# EAGLE design SPI2Parallel_v1p1 (EAGLE 9.6.2)

## Sheet 1 of 2
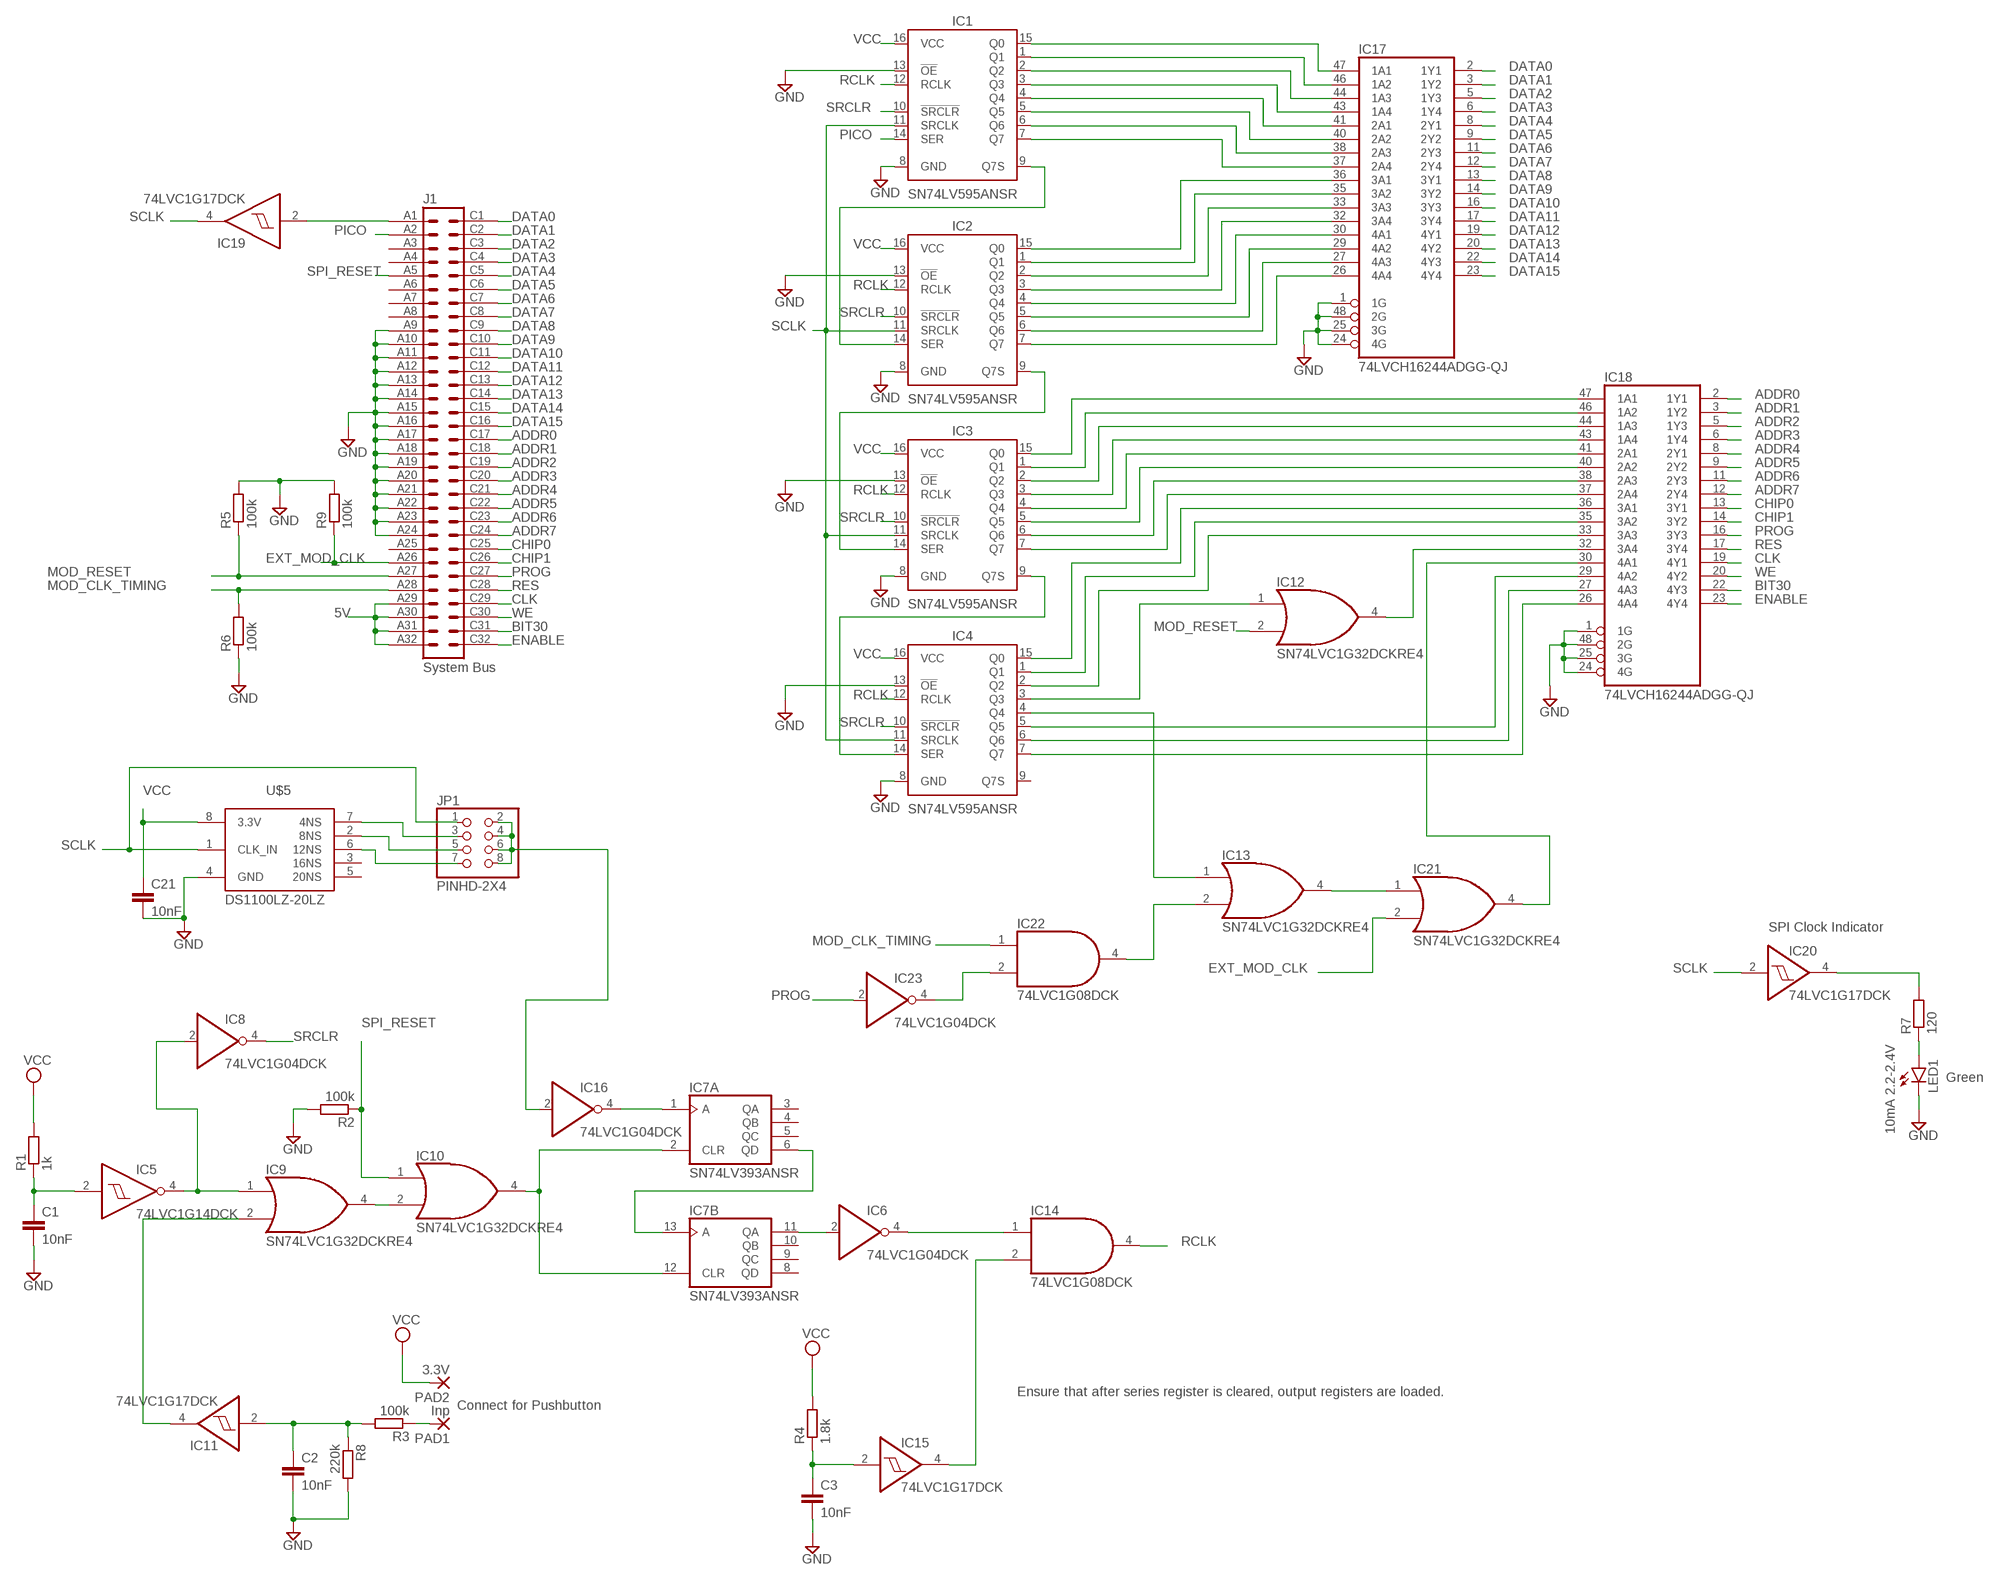
[diagram p0: schematic, sheet 1]

### Parts
C1  10nF  C-EUC0603  [C0603]
C2  10nF  C-EUC0603  [C0603]
C3  10nF  C-EUC0603  [C0603]
C21  10nF  C-EUC0603  [C0603]
IC1  SN74LV595ANSR  74HC595_SOIC  [SOIC127P600X175-16N]
IC2  SN74LV595ANSR  74HC595_SOIC  [SOIC127P600X175-16N]
IC3  SN74LV595ANSR  74HC595_SOIC  [SOIC127P600X175-16N]
IC4  SN74LV595ANSR  74HC595_SOIC  [SOIC127P600X175-16N]
IC5  74LVC1G14DCK  [SC70-5]
IC6  74LVC1G04DCK  [SC70-5]
IC7  SN74LV393ANSR  74AC393D  [SO14]
IC8  74LVC1G04DCK  [SC70-5]
IC9  SN74LVC1G32DCKRE4  74AHCT1G32DCK  [SC70-5]
IC10  SN74LVC1G32DCKRE4  74AHCT1G32DCK  [SC70-5]
IC11  74LVC1G17DCK  [SC70-5]
IC12  SN74LVC1G32DCKRE4  74AUC1G32DCK  [SC70-5]
IC13  SN74LVC1G32DCKRE4  74AUC1G32DCK  [SC70-5]
IC14  74LVC1G08DCK  [SC70-5]
IC15  74LVC1G17DCK  [SC70-5]
IC16  74LVC1G04DCK  [SC70-5]
IC17  74LVCH16244ADGG-QJ  74AC16244  [SSOP48DL]
IC18  74LVCH16244ADGG-QJ  74AC16244  [SSOP48DL]
IC19  74LVC1G17DCK  [SC70-5]
IC20  74LVC1G17DCK  [SC70-5]
IC21  SN74LVC1G32DCKRE4  74AUC1G32DCK  [SC70-5]
IC22  74LVC1G08DCK  [SC70-5]
IC23  74LVC1G04DCK  [SC70-5]
J1  System Bus  VG64P  [VG64P]
JP1  PINHD-2X4  [2X04]
LED1  10mA 2.2-2.4V  LED3MM  [LED3MM]
PAD1  Inp  SMD5  [SMD2,54-5,08]
PAD2  3.3V  SMD5  [SMD2,54-5,08]
R1  1k  R-EU_R0603  [R0603]
R2  100k  R-EU_R0603  [R0603]
R3  100k  R-EU_R0603  [R0603]
R4  1.8k  R-EU_R0603  [R0603]
R5  100k  R-EU_R0603  [R0603]
R6  100k  R-EU_R0603  [R0603]
R7  120  R-EU_R0603  [R0603]
R8  220k  R-EU_R0603  [R0603]
R9  100k  R-EU_R0603  [R0603]
U$5  DS1100LZ-20LZ  [SO-08]

### Nets
5V: J1.A29 J1.A30 J1.A31 J1.A32 ; also sheet 2
ADDR0: IC18.2(1Y1) J1.C17
ADDR1: IC18.3(1Y2) J1.C18
ADDR2: IC18.5(1Y3) J1.C19
ADDR3: IC18.6(1Y4) J1.C20
ADDR4: IC18.8(2Y1) J1.C21
ADDR5: IC18.9(2Y2) J1.C22
ADDR6: IC18.11(2Y3) J1.C23
ADDR7: IC18.12(2Y4) J1.C24
BIT30: IC18.22(4Y3) J1.C31
CHIP0: IC18.13(3Y1) J1.C25
CHIP1: IC18.14(3Y2) J1.C26
CLK: IC18.19(4Y1) J1.C29
DATA0: IC17.2(1Y1) J1.C1
DATA1: IC17.3(1Y2) J1.C2
DATA2: IC17.5(1Y3) J1.C3
DATA3: IC17.6(1Y4) J1.C4
DATA4: IC17.8(2Y1) J1.C5
DATA5: IC17.9(2Y2) J1.C6
DATA6: IC17.11(2Y3) J1.C7
DATA7: IC17.12(2Y4) J1.C8
DATA8: IC17.13(3Y1) J1.C9
DATA9: IC17.14(3Y2) J1.C10
DATA10: IC17.16(3Y3) J1.C11
DATA11: IC17.17(3Y4) J1.C12
DATA12: IC17.19(4Y1) J1.C13
DATA13: IC17.20(4Y2) J1.C14
DATA14: IC17.22(4Y3) J1.C15
DATA15: IC17.23(4Y4) J1.C16
ENABLE: IC18.23(4Y4) J1.C32
EXT_MOD_CLK: IC21.2(I1) J1.A26 R9.1
GND: C1.2 C2.2 C3.2 C21.2 IC1.8(GND) IC1.13(!OE) IC2.8(GND) IC2.13(!OE) IC3.8(GND) IC3.13(!OE) IC4.8(GND) IC4.13(!OE) IC17.1(1G) IC17.24(4G) IC17.25(3G) IC17.48(2G) IC18.1(1G) IC18.24(4G) IC18.25(3G) IC18.48(2G) J1.A9 J1.A10 J1.A11 J1.A12 J1.A13 J1.A14 J1.A15 J1.A16 J1.A17 J1.A18 J1.A19 J1.A20 J1.A21 J1.A22 J1.A23 J1.A24 LED1.K(C) R2.2 R5.2 R6.1 R8.2 R9.2 U$5.4(GND) ; also sheet 2
MOD_CLK_TIMING: IC22.1(I0) J1.A28 R6.2
MOD_RESET: IC12.2(I1) J1.A27 R5.1
N$1: IC1.9(Q7S) IC2.14(SER)
N$2: IC2.9(Q7S) IC3.14(SER)
N$3: IC3.9(Q7S) IC4.14(SER)
N$4: IC7.6(A:QD) IC7.13(B:A)
N$5: IC6.2(I) IC7.11(B:QA)
N$6: C1.1 IC5.2(I) R1.1
N$7: IC7.2(A:CLR) IC7.12(B:CLR) IC10.4(O)
N$8: IC9.4(O) IC10.2(I1)
N$9: IC5.4(O) IC8.2(I) IC9.1(I0)
N$10: C2.1 IC11.2(I) R3.2 R8.1
N$11: IC9.2(I1) IC11.4(O)
N$12: PAD1.1(P) R3.1
N$13: IC4.3(Q3) IC12.1(I0)
N$14: IC4.4(Q4) IC13.1(I0)
N$15: IC6.4(O) IC14.1(I0)
N$16: C3.1 IC15.2(I) R4.1
N$17: IC14.2(I1) IC15.4(O)
N$18: IC7.1(A:A) IC16.4(O)
N$19: IC1.15(Q0) IC17.47(1A1)
N$20: IC1.1(Q1) IC17.46(1A2)
N$21: IC1.2(Q2) IC17.44(1A3)
N$22: IC1.3(Q3) IC17.43(1A4)
N$23: IC1.4(Q4) IC17.41(2A1)
N$24: IC1.5(Q5) IC17.40(2A2)
N$25: IC1.6(Q6) IC17.38(2A3)
N$26: IC1.7(Q7) IC17.37(2A4)
N$27: IC2.15(Q0) IC17.36(3A1)
N$28: IC2.1(Q1) IC17.35(3A2)
N$29: IC2.2(Q2) IC17.33(3A3)
N$30: IC2.3(Q3) IC17.32(3A4)
N$31: IC2.4(Q4) IC17.30(4A1)
N$32: IC2.5(Q5) IC17.29(4A2)
N$33: IC2.6(Q6) IC17.27(4A3)
N$34: IC2.7(Q7) IC17.26(4A4)
N$35: IC3.15(Q0) IC18.47(1A1)
N$36: IC3.1(Q1) IC18.46(1A2)
N$37: IC3.2(Q2) IC18.44(1A3)
N$38: IC3.3(Q3) IC18.43(1A4)
N$39: IC3.4(Q4) IC18.41(2A1)
N$40: IC3.5(Q5) IC18.40(2A2)
N$41: IC3.6(Q6) IC18.38(2A3)
N$42: IC3.7(Q7) IC18.37(2A4)
N$43: IC4.15(Q0) IC18.36(3A1)
N$44: IC4.1(Q1) IC18.35(3A2)
N$45: IC4.2(Q2) IC18.33(3A3)
N$46: IC12.4(O) IC18.32(3A4)
N$47: IC18.30(4A1) IC21.4(O)
N$48: IC4.5(Q5) IC18.29(4A2)
N$49: IC4.6(Q6) IC18.27(4A3)
N$50: IC4.7(Q7) IC18.26(4A4)
N$51: IC16.2(I) JP1.2 JP1.4 JP1.6 JP1.8
N$52: JP1.7 U$5.6(12NS)
N$53: JP1.3 U$5.7(4NS)
N$54: JP1.5 U$5.2(8NS)
N$55: IC19.2(I) J1.A1
N$56: IC13.4(O) IC21.1(I0)
N$57: IC13.2(I1) IC22.4(O)
N$58: IC22.2(I1) IC23.4(O)
N$106: IC20.4(O) R7.2
N$123: LED1.A R7.1
PICO: IC1.14(SER) J1.A2
PROG: IC18.16(3Y3) IC23.2(I) J1.C27
RCLK: IC1.12(RCLK) IC2.12(RCLK) IC3.12(RCLK) IC4.12(RCLK) IC14.4(O)
RES: IC18.17(3Y4) J1.C28
SCLK: IC1.11(SRCLK) IC2.11(SRCLK) IC3.11(SRCLK) IC4.11(SRCLK) IC19.4(O) IC20.2(I) JP1.1 U$5.1(CLK_IN)
SPI_RESET: IC10.1(I0) J1.A5 R2.1
SRCLR: IC1.10(!SRCLR) IC2.10(!SRCLR) IC3.10(!SRCLR) IC4.10(!SRCLR) IC8.4(O)
VCC: C21.1 IC1.16(VCC) IC2.16(VCC) IC3.16(VCC) IC4.16(VCC) PAD2.1(P) R1.2 R4.2 U$5.8(3.3V) ; also sheet 2
WE: IC18.20(4Y2) J1.C30
Unconnected: IC4.9(Q7S) IC7.3(A:QA) IC7.4(A:QB) IC7.5(A:QC) IC7.8(B:QD) IC7.9(B:QC) IC7.10(B:QB) J1.A3 J1.A4 J1.A6 J1.A7 J1.A8 J1.A25 U$5.3(16NS) U$5.5(20NS)

### Notes on the sheet
- SPI Clock Indicator
- Green
- Ensure that after series register is cleared, output registers are loaded.
- Connect for Pushbutton

## Sheet 2 of 2
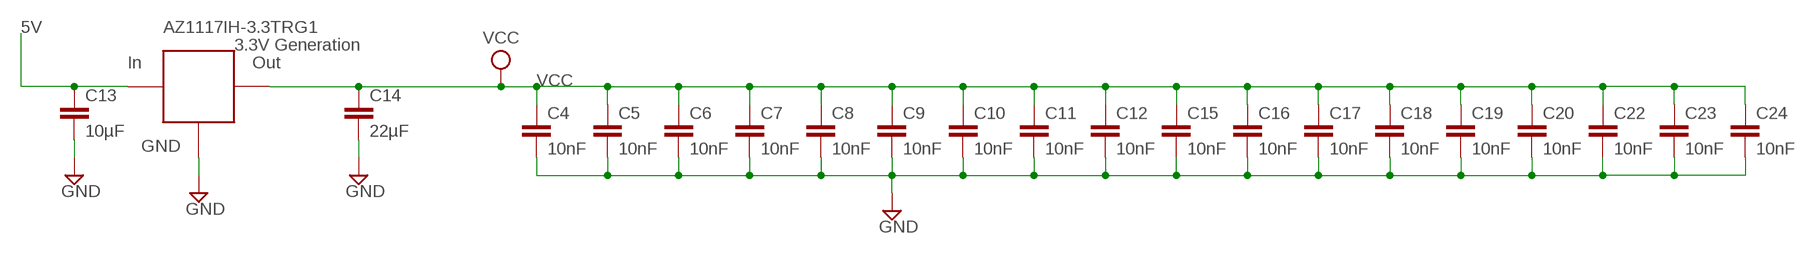
[diagram p1: schematic, sheet 2]

### Parts
C4  10nF  C-EUC0603  [C0603]
C5  10nF  C-EUC0603  [C0603]
C6  10nF  C-EUC0603  [C0603]
C7  10nF  C-EUC0603  [C0603]
C8  10nF  C-EUC0603  [C0603]
C9  10nF  C-EUC0603  [C0603]
C10  10nF  C-EUC0603  [C0603]
C11  10nF  C-EUC0603  [C0603]
C12  10nF  C-EUC0603  [C0603]
C13  10µF  C-EUC1206  [C1206]
C14  22µF  C-EUC1206  [C1206]
C15  10nF  C-EUC0603  [C0603]
C16  10nF  C-EUC0603  [C0603]
C17  10nF  C-EUC0603  [C0603]
C18  10nF  C-EUC0603  [C0603]
C19  10nF  C-EUC0603  [C0603]
C20  10nF  C-EUC0603  [C0603]
C22  10nF  C-EUC0603  [C0603]
C23  10nF  C-EUC0603  [C0603]
C24  10nF  C-EUC0603  [C0603]
U$9  AZ1117IH-3.3TRG1  LT1117  [SOT223]

### Nets
5V: C13.1 U$9.3(IN) ; also sheet 1
GND: C4.2 C5.2 C6.2 C7.2 C8.2 C9.2 C10.2 C11.2 C12.2 C13.2 C14.2 C15.2 C16.2 C17.2 C18.2 C19.2 C20.2 C22.2 C23.2 C24.2 U$9.1(GND) ; also sheet 1
VCC: C4.1 C5.1 C6.1 C7.1 C8.1 C9.1 C10.1 C11.1 C12.1 C14.1 C15.1 C16.1 C17.1 C18.1 C19.1 C20.1 C22.1 C23.1 C24.1 U$9.2(VCC) U$9.4(VCC) ; also sheet 1

### Notes on the sheet
- 3.3V Generation

## Power pins joined to a net without a drawn wire
GND: IC5.3(GND) IC6.3(GND) IC7.7(P:GND) IC8.3(GND) IC9.3(GND) IC10.3(GND) IC11.3(GND) IC12.3(GND) IC13.3(GND) IC14.3(GND) IC15.3(GND) IC16.3(GND) IC17.4(GND) IC17.10(GND) IC17.15(GND) IC17.21(GND) IC17.28(GND) IC17.34(GND) IC17.39(GND) IC17.45(GND) IC18.4(GND) IC18.10(GND) IC18.15(GND) IC18.21(GND) IC18.28(GND) IC18.34(GND) IC18.39(GND) IC18.45(GND) IC19.3(GND) IC20.3(GND) IC21.3(GND) IC22.3(GND) IC23.3(GND)
VCC: IC5.5(VCC) IC6.5(VCC) IC7.14(P:VCC) IC8.5(VCC) IC9.5(VCC) IC10.5(VCC) IC11.5(VCC) IC12.5(VCC) IC13.5(VCC) IC14.5(VCC) IC15.5(VCC) IC16.5(VCC) IC17.7(VCC) IC17.18(VCC) IC17.31(VCC) IC17.42(VCC) IC18.7(VCC) IC18.18(VCC) IC18.31(VCC) IC18.42(VCC) IC19.5(VCC) IC20.5(VCC) IC21.5(VCC) IC22.5(VCC) IC23.5(VCC)

## Library data of the parts
C1-C24 = rcl:C-EU: CAPACITOR, European symbol; SPICEPREFIX: C
IC1-IC4 = IC_Logic:74HC595: 8-Bit Shift Registers Reference Datasheet <https://www.ti.com/lit/ds/symlink/sn74hc595.pdf?ts=1637559852861&ref_url=https%253A%252F%252Fwww.google.com%252F>; CATEGORY: IC_Logic; DESCRIPTION: 8-Bit Shift Registers; MANUFACTURER: Generic; MPN: Generic; SUB-CATEGORY: Shift Register; TYPE: 8-Bit
IC5 = 74xx-little-us:74*1G14: Single Schmitt-Trigger Inverter Gate
IC6 IC8 IC16 IC23 = 74xx-little-de:74*1G04: INVERTER Gate
IC7 = 74xx-eu:74*393: Dual 4-bit decade and binary COUNTER
IC9 IC10 IC12 IC13 IC21 = 74xx-little-us:74*1G32: 2-input OR gate
IC11 IC15 IC20 = 74xx-little-de:74*1G17: Single Schmitt-Trigger Buffer
IC14 IC22 = 74xx-little-us:74*1G08: 2-input AND gate
IC17 IC18 = 74ac-logic:74AC16244: 16-bit BUFFER/LINE DRIVER, 3-state
IC19 = 74xx-little-us:74*1G17: Single Schmitt-Trigger Buffer
J1 = 19inch:VG64: PCB EUROCARD, 64-pin type C/AC, 2.54 mm
JP1 = Connector:PINHD-2X4: PIN HEADER; CATEGORY: CONNECTOR; SUB-CATEGORY: PIN-HEADER
LED1 = led:LED: LED OSRAM: - CHIPLED LG R971, LG N971, LY N971, LG Q971, LY Q971, LO R971, LY R971 LH N974, LH R974 LS Q976, LO Q976, LY Q976 LO Q996 - Hyper CHIPLED LW Q18S LB Q993, LB Q99A, LB R99A - SideLED LS A670, LO A670, LY A670, LG A670, LP A670 LB A673, LV A673, LT A673, LW A673 LH A674 LY A675 LS A676, LA A676, LO A676, LY A676, LW A676 LS A679, LY A679, LG A679 - Hyper Micro SIDELED® LS Y876, LA Y876, LO Y876, LY Y876 LT Y87S - SmartLED LW L88C, LW L88S LB L89C, LB L89S, LG L890 LS L89K, LO L89K, LY L89K LS L896, LA L896, LO L896, LY L896 - TOPLED LS T670, LO T670, LY T670, LG T670, LP T670 LSG T670, LSP T670, LSY T670, LOP T670, LYG T670 LG T671, LOG T671, LSG T671 LB T673, LV T673, LT T673, LW T673 LH T674 LS T676, LA T676, LO T676, LY T676, LB T676, LH T676, LSB T676, LW T676 LB T67C, LV T67C, LT T67C, LS T67K, LO T67K, LY T67K, LW E67C LS E67B, LA E67B, LO E67B, LY E67B, LB E67C, LV E67C, LT E67C LW T67C LS T679, LY T679, LG T679 LS T770, LO T770, LY T770, LG T770, LP T770 LB T773, LV T773, LT T773, LW T773 LH T774 LS E675, LA E675, LY E675, LS T675 LS T776, LA T776, LO T776, LY T776, LB T776 LHGB T686 LT T68C, LB T68C - Hyper Mini TOPLED® LB M676 - Mini TOPLED Santana® LG M470 LS M47K, LO M47K, LY M47K Source: http://www.osram.convergy.de LUXEON: - LUMILED® LXK2-PW12-R00, LXK2-PW12-S00, LXK2-PW14-U00, LXK2-PW14-V00 LXK2-PM12-R00, LXK2-PM12-S00, LXK2-PM14-U00 LXK2-PE12-Q00, LXK2-PE12-R00, LXK2-PE12-S00, LXK2-PE14-T00, LXK2-PE14-U00 LXK2-PB12-K00, LXK2-PB12-L00, LXK2-PB12-M00, LXK2-PB14-N00, LXK2-PB14-P00, LXK2-PB14-Q00 LXK2-PR12-L00, LXK2-PR12-M00, LXK2-PR14-Q00, LXK2-PR14-R00 LXK2-PD12-Q00, LXK2-PD12-R00, LXK2-PD12-S00 LXK2-PH12-R00, LXK2-PH12-S00 LXK2-PL12-P00, LXK2-PL12-Q00, LXK2-PL12-R00 Source: www.luxeon.com KINGBRIGHT: KA-3528ASYC Source: www.kingbright.com
PAD1 PAD2 = wirepad:SMD5: SMD PAD
R1-R9 = rcl:R-EU_: RESISTOR, European symbol; SPICEPREFIX: R
U$5 = Orzada:DS1100LZ-20: 5-Tap Timing Element, 4,8,12,16,20 ns delay.
U$9 = Orzada:LT1117

## Board
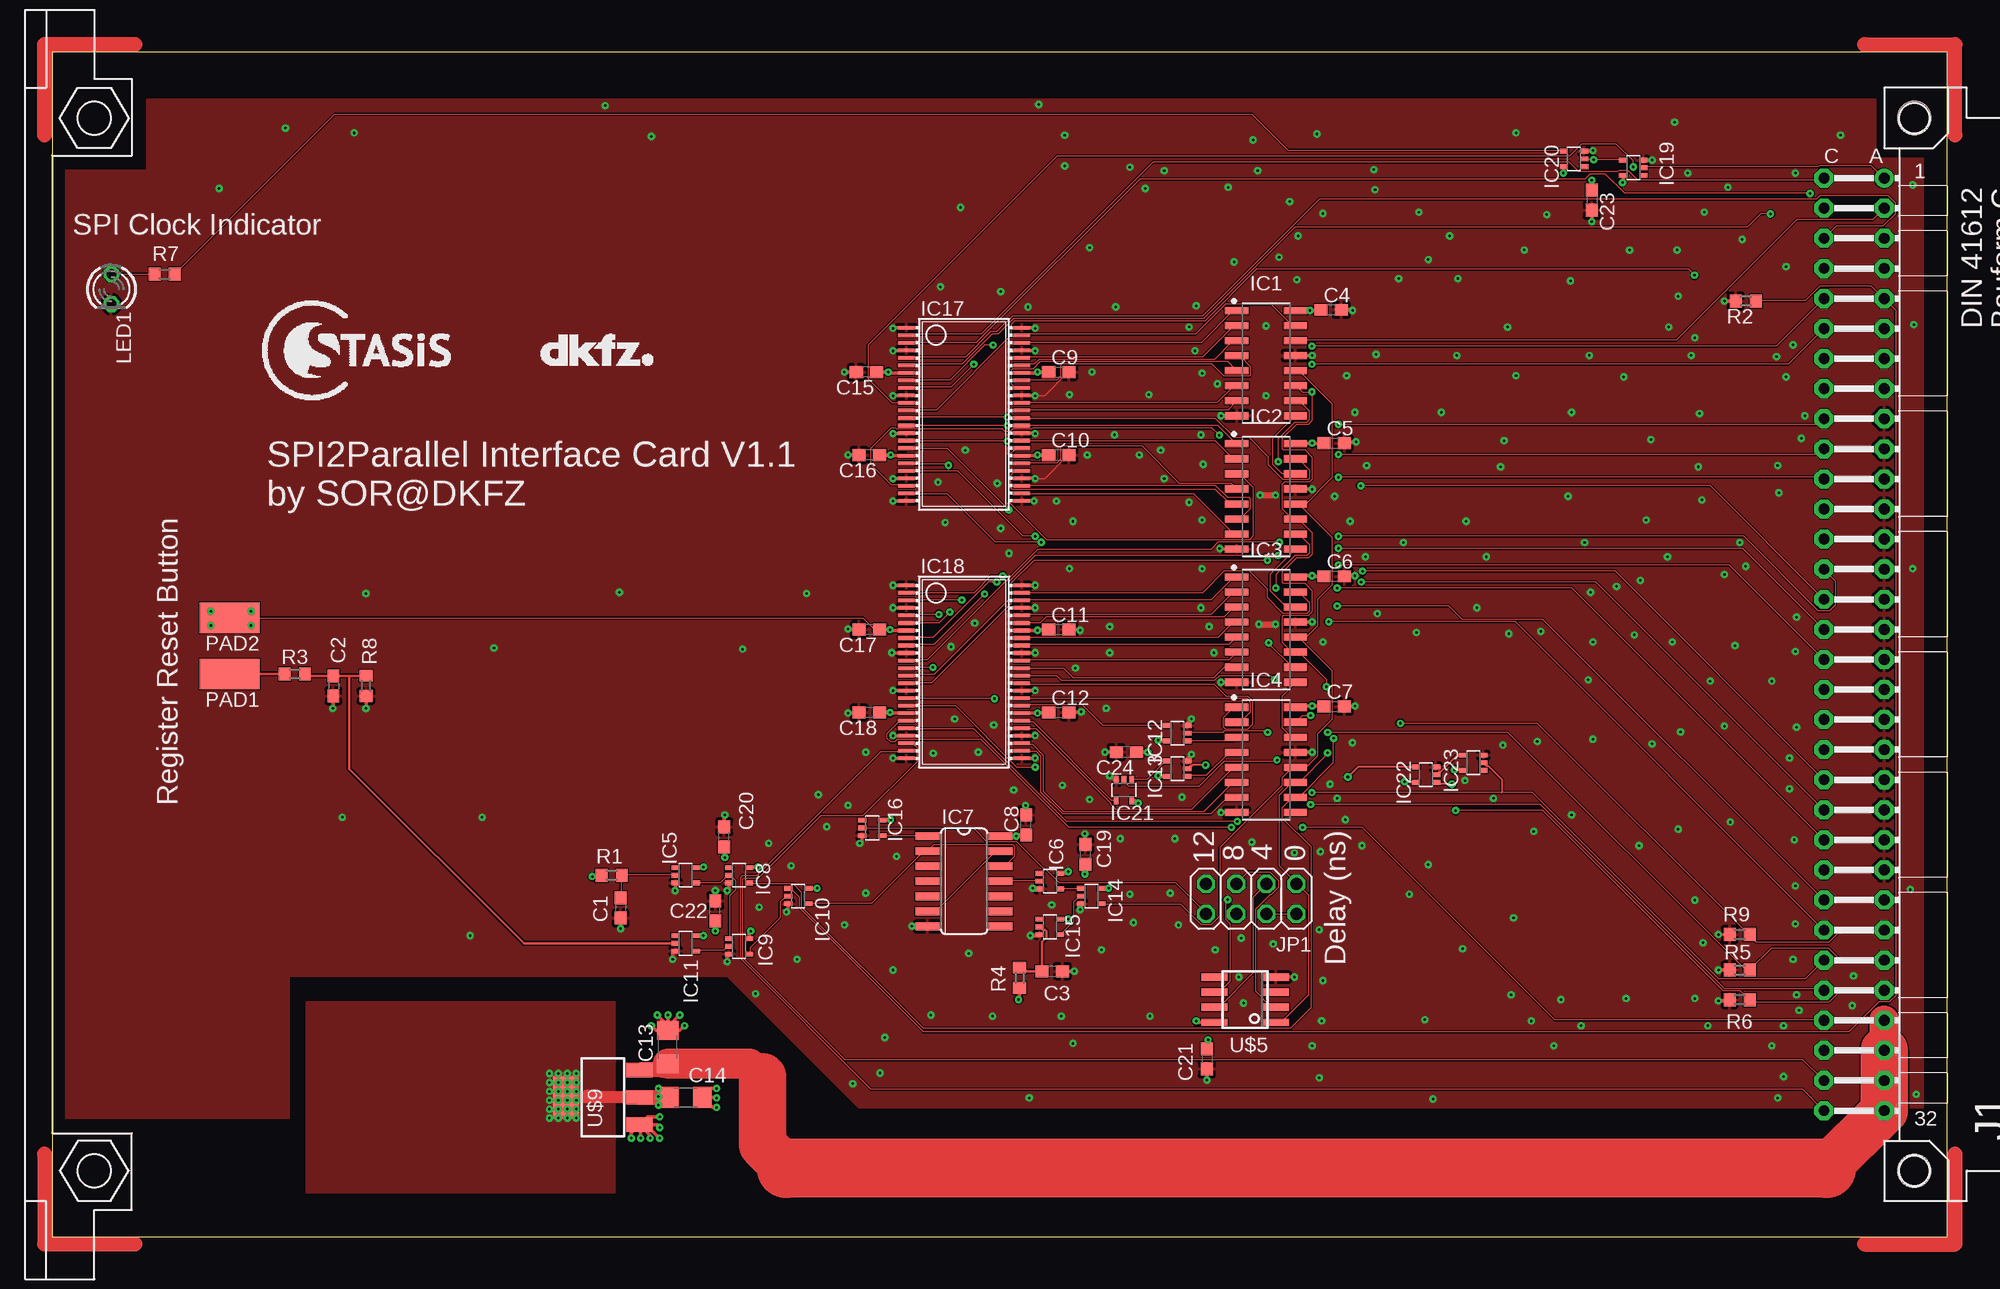
[diagram p2: board, top side]
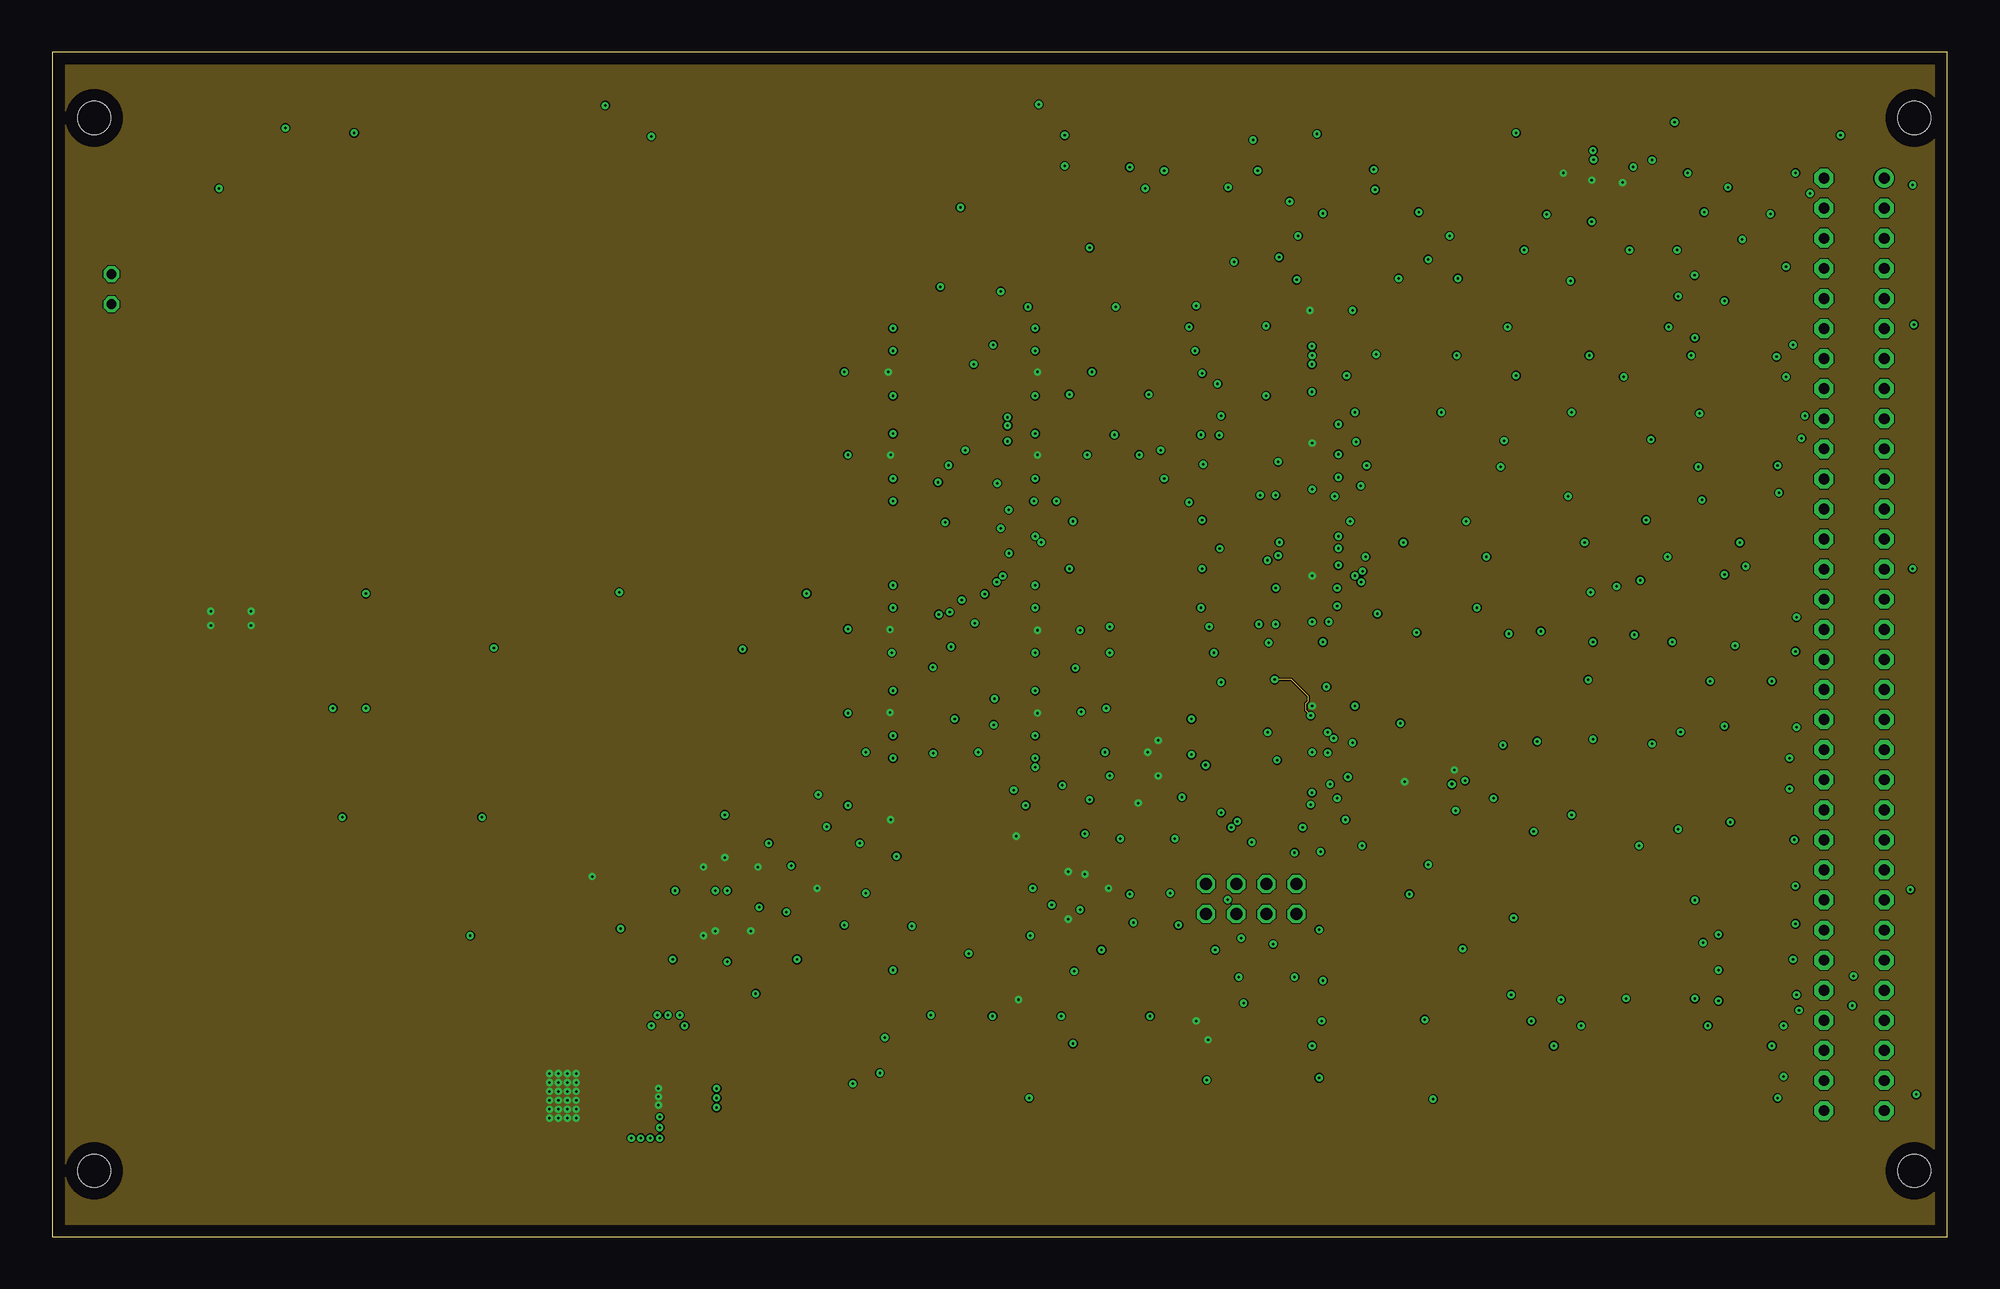
[diagram p3: board, inner layer VCC]
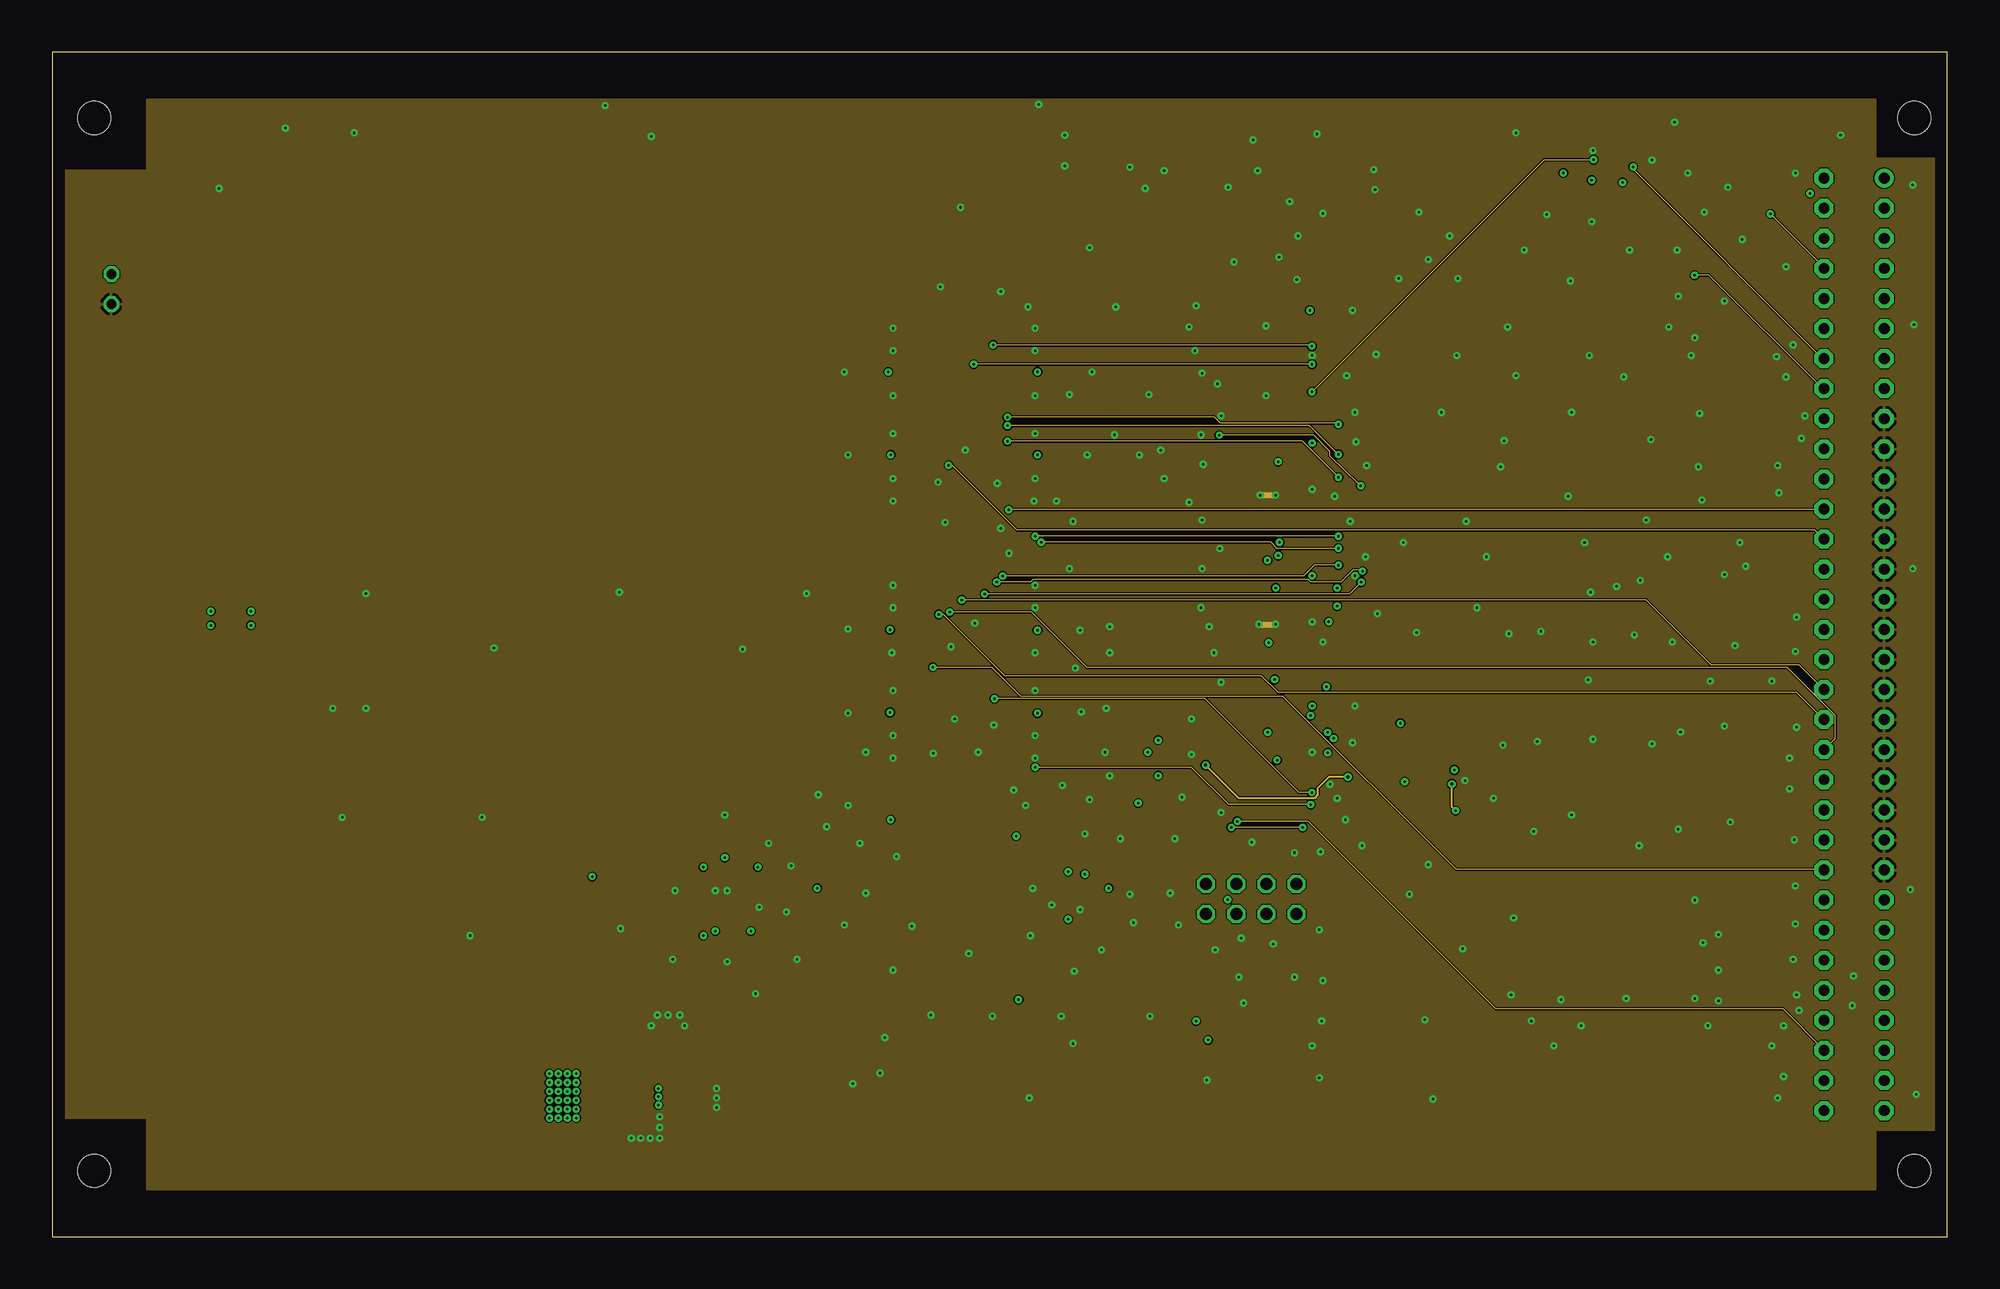
[diagram p4: board, inner layer Route15]
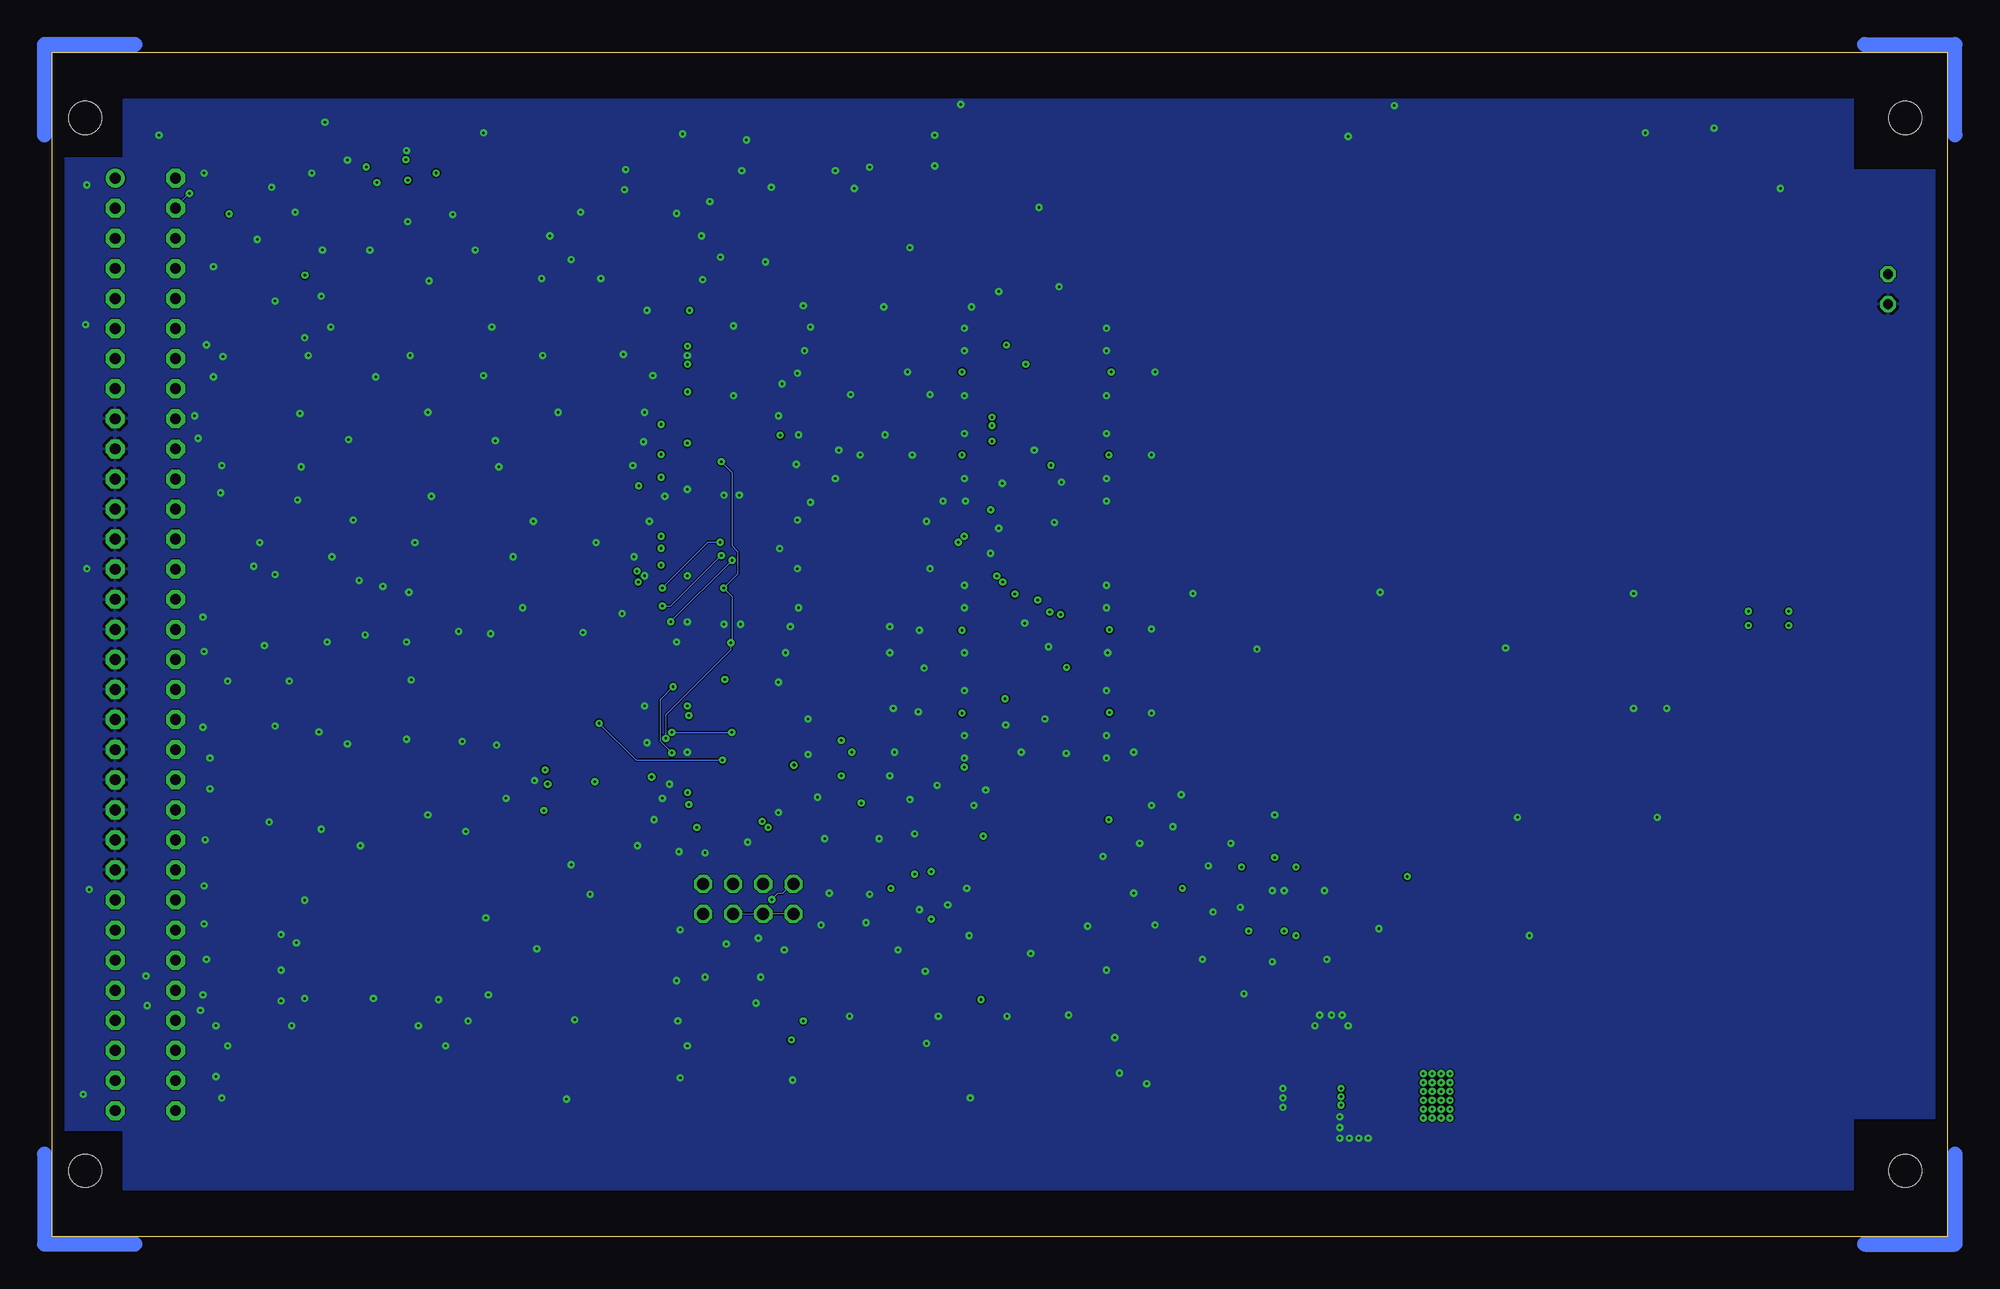
[diagram p5: board, bottom side, seen from below]

Size 160.02 x 100.03 mm. Coordinates in mm from the lower left corner, seen from the top.
Copper layers (1+2*15+16): Top 0.035mm / dielectric 0.14mm / VCC 0.035mm / dielectric 1.2mm / Route15 0.035mm / dielectric 0.14mm / Bottom 0.035mm
Design rules "default *": minimum track width 4mil, minimum drill 0.2mm, track to track 4mil, track to pad 4mil, pad to pad 4mil, via to via 4mil, smd to smd 4mil, copper to edge 40mil, drill to drill 6mil, minimum pad ring 10mil, minimum via ring 8mil, stop-mask expansion 4mil, vias tented up to drill 10mil, thermal gap 10mil

### Footprints (pad centres in the part's own frame; a part is rotated, then mirrored left to right if it is on the bottom)
C0603 = smd 1.1 x 1: 1 -0.85,0; 2 0.85,0
C1206 = smd 1.6 x 1.8: 1 -1.4,0; 2 1.4,0
SOIC127P600X175-16N = smd 1.969 x 0.602: 1 -2.474,4.445; 2 -2.474,3.175; 3 -2.474,1.905; 4 -2.474,0.635; 5 -2.474,-0.635; 6 -2.474,-1.905; 7 -2.474,-3.175; 8 -2.474,-4.445; 9 2.474,-4.445; 10 2.474,-3.175; 11 2.474,-1.905; 12 2.474,-0.635; 13 2.474,0.635; 14 2.474,1.905; 15 2.474,3.175; 16 2.474,4.445
SC70-5 = smd 0.4 x 0.7: 1 -0.65,-0.85; 2 0,-0.85; 3 0.65,-0.85; 4 0.65,0.85; 5 -0.65,0.85
SO14 = smd 0.66 x 2.032: 1 -3.81,-3.073; 2 -2.54,-3.073; 3 -1.27,-3.073; 4 0,-3.073; 5 1.27,-3.073; 6 2.54,-3.073; 7 3.81,-3.073; 8 3.81,3.073; 9 2.54,3.073; 10 1.27,3.073; 11 0,3.073; 12 -1.27,3.073; 13 -2.54,3.073; 14 -3.81,3.073
SSOP48DL = smd 0.305 x 1.422: 1 -6.985,-4.877; 2 -6.35,-4.877; 3 -5.715,-4.877; 4 -5.08,-4.877; 5 -4.445,-4.877; 6 -3.81,-4.877; 7 -3.175,-4.877; 8 -2.54,-4.877; 9 -1.905,-4.877; 10 -1.27,-4.877; 11 -0.635,-4.877; 12 0,-4.877; 13 0.635,-4.877; 14 1.27,-4.877; 15 1.905,-4.877; 16 2.54,-4.877; 17 3.175,-4.877; 18 3.81,-4.877; 19 4.445,-4.877; 20 5.08,-4.877; 21 5.715,-4.877; 22 6.35,-4.877; 23 6.985,-4.877; 24 7.62,-4.877; 25 7.62,4.877; 26 6.985,4.877; 27 6.35,4.877; 28 5.715,4.877; 29 5.08,4.877; 30 4.445,4.877; 31 3.81,4.877; 32 3.175,4.877; 33 2.54,4.877; 34 1.905,4.877; 35 1.27,4.877; 36 0.635,4.877; 37 0,4.877; 38 -0.635,4.877; 39 -1.27,4.877; 40 -1.905,4.877; 41 -2.54,4.877; 42 -3.175,4.877; 43 -3.81,4.877; 44 -4.445,4.877; 45 -5.08,4.877; 46 -5.715,4.877; 47 -6.35,4.877; 48 -6.985,4.877
VG64P = drill 0.914 pad 1.6: A1 154.94,39.37 | drill 0.914 pad 1.6 octagon: A2 154.94,36.83; A3 154.94,34.29; A4 154.94,31.75; A5 154.94,29.21; A6 154.94,26.67; A7 154.94,24.13; A8 154.94,21.59; A9 154.94,19.05; A10 154.94,16.51; A11 154.94,13.97; A12 154.94,11.43; A13 154.94,8.89; A14 154.94,6.35; A15 154.94,3.81; A16 154.94,1.27; A17 154.94,-1.27; A18 154.94,-3.81; A19 154.94,-6.35; A20 154.94,-8.89; A21 154.94,-11.43; A22 154.94,-13.97; A23 154.94,-16.51; A24 154.94,-19.05; A25 154.94,-21.59; A26 154.94,-24.13; A27 154.94,-26.67; A28 154.94,-29.21; A29 154.94,-31.75; A30 154.94,-34.29; A31 154.94,-36.83; A32 154.94,-39.37; C1 149.86,39.37; C2 149.86,36.83; C3 149.86,34.29; C4 149.86,31.75; C5 149.86,29.21; C6 149.86,26.67; C7 149.86,24.13; C8 149.86,21.59; C9 149.86,19.05; C10 149.86,16.51; C11 149.86,13.97; C12 149.86,11.43; C13 149.86,8.89; C14 149.86,6.35; C15 149.86,3.81; C16 149.86,1.27; C17 149.86,-1.27; C18 149.86,-3.81; C19 149.86,-6.35; C20 149.86,-8.89; C21 149.86,-11.43; C22 149.86,-13.97; C23 149.86,-16.51; C24 149.86,-19.05; C25 149.86,-21.59; C26 149.86,-24.13; C27 149.86,-26.67; C28 149.86,-29.21; C29 149.86,-31.75; C30 149.86,-34.29; C31 149.86,-36.83; C32 149.86,-39.37 | hole 2.794: 3.81,44.45; 3.81,-44.45; 157.48,44.45; 157.48,-44.45
2X04 = drill 1.016 octagon: 1 -3.81,-1.27; 2 -3.81,1.27; 3 -1.27,-1.27; 4 -1.27,1.27; 5 1.27,-1.27; 6 1.27,1.27; 7 3.81,-1.27; 8 3.81,1.27
LED3MM = drill 0.813 octagon: A -1.27,0; K 1.27,0
SMD2,54-5,08 = smd 2.54 x 5.08: 1 0,0
R0603 = smd 1 x 1.1: 1 -0.85,0; 2 0.85,0
SO-08 = smd 0.6 x 2.2: 1 -1.905,-2.6; 2 -0.635,-2.6; 3 0.635,-2.6; 4 1.905,-2.6; 5 1.905,2.6; 6 0.635,2.6; 7 -0.635,2.6; 8 -1.905,2.6
SOT223 = smd 1.219 x 2.235: 1 -2.311,-3.099; 2 0,-3.099; 3 2.311,-3.099 | smd 3.6 x 2.2: 4 0,3.099

### Placement (x,y rotation side)
C1  48,27.76 270 top
C2  23.75,46.51 270 top
C3  84.45,22.41 0 top
C4  108,78.26 0 top
C5  108.25,67.01 0 top
C6  108.25,55.76 0 top
C7  108.25,44.76 0 top
C8  82.25,34.76 90 top
C9  85,73.01 0 top
C10  85,66.01 0 top
C11  85,51.26 0 top
C12  85,44.26 0 top
C13  52,16.01 90 top
C14  53.5,11.76 0 top
C15  68.75,73.01 180 top
C16  69,66.01 180 top
C17  69,51.26 180 top
C18  69,44.26 180 top
C19  87.25,32.26 90 top
C20  56.75,33.76 90 top
C21  97.5,15.01 270 top
C22  56,27.51 90 top
C23  130,87.51 270 top
C24  90.7,40.91 180 top
IC1  102.5,73.76 0 top
IC2  102.5,62.51 0 top
IC3  102.5,51.26 0 top
IC4  102.5,40.26 0 top
IC5  53.5,30.51 270 top
IC6  84.25,30.01 270 top
IC7  77,30.01 270 top
IC8  58,30.51 270 top
IC9  58,24.51 270 top
IC10  63,28.76 270 top
IC11  53.5,24.76 270 top
IC12  95,42.51 90 top
IC13  95,39.51 90 top
IC14  87.75,28.76 270 top
IC15  84.25,26.16 270 top
IC16  69.25,34.51 270 top
IC17  77,69.76 270 top
IC18  77,48.01 270 top
IC19  133.5,90.26 90 top
IC20  128.5,91.01 90 top
IC21  90.5,37.71 180 top
IC22  116,39.01 90 top
IC23  120,40.01 90 top
J1  -0.25,50.01 0 top
JP1  101.25,28.51 180 top
LED1  5,80.01 270 top
PAD1  15,47.51 90 top
PAD2  15,52.26 90 top
R1  47.25,30.51 180 top
R2  143,79.01 180 top
R3  20.5,47.51 0 top
R4  81.7,21.86 270 top
R5  142.5,22.51 180 top
R6  142.5,20.01 0 top
R7  9.5,81.26 0 top
R8  26.5,46.51 270 top
R9  142.5,25.51 180 top
U$1  [LOGO_STASIS]  26.7,74.61 0 top
U$2  [LOGO_DKFZ]  41.3,73.51 0 top
U$5  100.75,20.01 90 top
U$9  46.5,11.76 90 top

### Tracks (layer width: path | path; a pad name or v marks a point on that pad's centre or on a via)
5V
  Top 1.27: C13.1 51.46,14.07 U$9.3
  Top 2.54: J1.A29 J1.A30 | 60,13.51 58.9,14.61 C13.1
  Top 4: J1.A30 J1.A31 J1.A32 149.81,5.76 | 62,5.76 60,7.76 60,13.51
  Top 5: 149.81,5.76 62,5.76
ADDR0  (via drill 0.2)
  Top 0.102: v80.26,55.79 79.24,55.79 77.82,54.37 72.13,54.37 IC18.2 | v108.61,56.71 141.63,56.71 149.55,48.78 J1.C17
  Route15 0.102: v80.26,55.79 105.66,55.79 106.57,56.71 v108.61,56.71
ADDR1  (via drill 0.2)
  Top 0.102: v76.81,53.76 72.13,53.76 IC18.3
  Route15 0.102: v76.81,53.76 134.62,53.76 140.1,48.27 147.52,48.27 149.55,46.24 J1.C18
ADDR2  (via drill 0.2)
  Top 0.102: v74.88,52.54 72.13,52.54 IC18.5
  Route15 0.102: v74.88,52.54 75.28,52.54 80.46,47.36 102.1,47.36 103.53,45.94 147.32,45.94 149.55,43.7 J1.C19
ADDR3  (via drill 0.2)
  Top 0.102: v75.79,52.74 74.88,51.83 72.13,51.83 IC18.6
  Route15 0.102: v75.79,52.74 82.7,52.74 87.37,48.07 146.5,48.07 150.57,44.01 150.57,42.07 149.65,41.16 J1.C20
ADDR4  (via drill 0.2)
  Top 0.102: v79.75,55.28 79.04,55.28 74.37,50.61 72.13,50.61 IC18.8 | v110.64,56.2 131.97,56.2 149.55,38.62 J1.C21
  Route15 0.102: v79.75,55.28 82.6,55.28 82.8,55.49 106.07,55.49 106.27,55.28 108.81,55.28 109.83,56.3 110.54,56.3 v110.64,56.2
ADDR5  (via drill 0.2)
  Top 0.102: v78.74,54.27 74.47,50 72.13,50 IC18.9 | v110.54,55.28 130.35,55.28 149.55,36.08 J1.C22
  Route15 0.102: v78.74,54.27 109.52,54.27 v110.54,55.28
ADDR6  (via drill 0.2)
  Top 0.102: v103.63,58.64 98.45,58.64 97.84,58.03 83.21,58.03 73.86,48.68 72.13,48.68 IC18.11 | v108.5,54.77 128.32,54.77 149.55,33.54 J1.C23
  Bottom 0.102: v103.63,58.64 104.64,58.64 v108.5,54.77
ADDR7  (via drill 0.2)
  Top 0.102: v74.37,48.07 72.13,48.07 IC18.12
  Route15 0.102: v74.37,48.07 79.35,48.07 81.78,45.63 103.93,45.63 118.56,31 149.55,31 J1.C24
BIT30
  Top 0.102: IC18.22 72.13,41.57 72.74,41.57 73.05,41.26 73.05,40.14 68.47,35.57 64.92,35.57 59.64,30.29 58.42,30.29 58.31,30.19 58.31,23.58 66.95,14.95 147.82,14.95 149.55,13.22 J1.C31
CHIP0  (via drill 0.2)
  Top 0.102: v103.53,57.52 103.42,57.62 102.41,57.62 102.31,57.52 83,57.52 80.77,55.28 80.77,53.76 74.47,47.46 72.13,47.46 IC18.13 | v108.5,53.25 117.95,53.25 119.07,52.13 125.88,52.13 149.55,28.46 J1.C25
  Bottom 0.102: v103.53,57.52 107.79,53.25 v108.5,53.25
CHIP1  (via drill 0.2)
  Top 0.102: v102.61,57.11 82.9,57.11 80.97,55.18 80.97,53.45 74.27,46.75 72.13,46.75 IC18.14 | v107.79,51.93 123.54,51.93 149.55,25.92 J1.C26
  Bottom 0.102: v107.79,51.93 v102.61,57.11
CLK  (via drill 0.2)
  Top 0.102: v99.56,34.56 85.85,34.56 78.43,41.97 71.32,41.97 71.12,41.77 70.81,41.77 70.51,42.07 70.51,42.48 71.52,43.5 72.03,43.5 IC18.19 | v105.59,34.56 110.64,34.56 126.89,18.3 149.55,18.3 J1.C29
  Route15 0.102: v105.59,34.56 v99.56,34.56
DATA0
  Top 0.102: IC17.2 72.13,76.21 78.43,76.21 92.96,90.74 128.11,90.74 128.93,89.93 132.18,89.93 132.28,90.03 133.09,90.03 133.91,89.22 149.45,89.22 149.55,89.32 J1.C1
DATA1  (via drill 0.2)
  Top 0.102: v148.43,88.1 132.79,88.1 131.16,89.73 129.84,89.73 129.43,89.32 91.84,89.32 78.02,75.5 72.13,75.5 IC17.3
  Bottom 0.102: v148.43,88.1 149.65,86.88 J1.C2
DATA2
  Top 0.102: IC17.5 72.13,74.28 77.11,74.28 79.24,76.42 79.75,76.42 81.07,77.74 97.13,77.74 106.98,87.59 148.94,87.59 149.25,87.9 155.04,87.9 155.65,87.29 155.65,86.37 154.63,85.36 150.67,85.36 149.65,84.34 J1.C3
DATA3  (via drill 0.2)
  Top 0.102: v145.08,86.37 144.27,86.37 143.15,85.25 104.95,85.25 97.23,77.53 81.17,77.53 79.85,76.21 79.35,76.21 76.81,73.67 72.13,73.67 IC17.6
  Route15 0.102: 149.65,81.8 v145.08,86.37
  Route15 0.2: J1.C4 149.64,81.8 149.65,81.8
DATA4  (via drill 0.2)
  Top 0.102: v79.45,75.3 78.74,75.3 75.79,72.35 72.13,72.35 IC17.8 | v106.37,75.2 145.59,75.2 149.55,79.16 J1.C5
  Route15 0.102: v79.45,75.3 106.27,75.3 v106.37,75.2
DATA5  (via drill 0.2)
  Top 0.102: v77.82,73.67 75.89,71.74 72.13,71.74 IC17.9 | v106.37,73.67 146.61,73.67 149.55,76.62 J1.C6
  Route15 0.102: v106.37,73.67 v77.82,73.67
DATA6  (via drill 0.2)
  Top 0.102: v133.5,90.33 133.5,90.84 132.08,92.27 129.13,92.27 128.11,91.25 84.83,91.25 68.88,75.3 68.88,72.45 70.91,70.42 72.03,70.42 IC17.11
  Route15 0.102: 149.35,74.28 133.5,90.13 v133.5,90.33
  Route15 0.2: J1.C7 149.49,74.14 149.35,74.28
DATA7  (via drill 0.2)
  Top 0.102: v138.68,81.19 138.17,81.7 101.7,81.7 97.33,77.33 81.28,77.33 80.97,77.03 80.97,76.11 74.67,69.81 72.13,69.81 IC17.12
  Route15 0.102: v138.68,81.19 139.9,81.19 149.54,71.55
  Route15 0.2: J1.C8 149.56,71.55 149.54,71.55
DATA8  (via drill 0.2)
  Top 0.102: v80.67,69.2 72.13,69.2 IC17.13 | v108.61,68.59 149.15,68.59 149.55,69 J1.C9
  Route15 0.102: v80.67,69.2 98.14,69.2 98.65,68.69 108.5,68.69 v108.61,68.59
DATA9  (via drill 0.2)
  Top 0.102: v80.67,68.49 72.13,68.49 IC17.14 | v108.61,66.05 149.15,66.05 149.55,66.46 J1.C10
  Route15 0.102: v80.67,68.49 106.17,68.49 v108.61,66.05
DATA10  (via drill 0.2)
  Top 0.102: v80.67,67.17 72.13,67.17 IC17.16 | v108.61,64.12 149.45,64.12 149.55,64.02 J1.C11
  Route15 0.102: v80.67,67.17 105.56,67.17 v108.61,64.12
DATA11  (via drill 0.2)
  Top 0.102: v80.77,61.38 75.59,66.56 72.13,66.56 IC17.17
  Route15 0.102: v80.77,61.38 149.55,61.38 J1.C12
DATA12  (via drill 0.2)
  Top 0.102: v75.69,65.14 75.59,65.24 72.13,65.24 IC17.19
  Route15 0.102: v75.69,65.14 75.99,65.14 81.48,59.65 148.84,59.65 149.55,58.94 J1.C13
DATA13  (via drill 0.2)
  Top 0.102: v83,59.14 81.99,59.14 76.5,64.63 72.13,64.63 IC17.20 | v108.61,59.14 142.85,59.14 149.15,52.84 150.06,52.84 150.57,53.35 150.57,55.38 149.65,56.3 J1.C14
  Route15 0.102: v108.61,59.14 v83,59.14
DATA14  (via drill 0.2)
  Top 0.102: v98.55,67.68 97.94,68.29 82.8,68.29 82.7,68.19 81.07,68.19 80.87,67.98 80.46,67.98 80.26,68.19 71.32,68.19 71.22,68.29 70.81,68.29 69.08,66.56 69.08,65.24 70.81,63.51 72.03,63.51 IC17.22 | v110.49,63.41 140.01,63.41 149.55,53.86 J1.C15
  Route15 0.102: v110.49,63.41 110.39,63.51 107.9,65.91 107.9,66.31 106.53,67.68 v98.55,67.68
DATA15  (via drill 0.2)
  Top 0.102: v83.51,58.64 79.65,58.64 75.59,62.7 72.13,62.7 IC17.23 | v108.61,58.13 142.74,58.13 149.55,51.32 J1.C16
  Route15 0.102: v83.51,58.64 102.92,58.64 103.42,58.13 v108.61,58.13
ENABLE
  Top 0.102: J1.C32 147.8,12.45 69.15,12.45 58.11,23.48 58.11,30.29 58.31,30.49 59.53,30.49 70,40.96 72.03,40.96 IC18.23
EXT_MOD_CLK  (via drill 0.2)
  Top 0.102: v103.43,40.24 103.33,40.14 98.95,40.14 96.82,38.01 90.93,38.01 90.72,38.21 90.72,38.32 90.52,38.52 IC21.2 | v113.84,43.34 125.42,43.34 143.25,25.51 R9.1 143.35,25.41 143.86,24.9 150.06,24.9 150.97,25.82 154.63,25.82 J1.A26
  Bottom 0.102: v103.43,40.24 110.73,40.24 v113.84,43.34
GND  (via drill 0.2)
  Top 0.102: C10.2 85.75,65.95 83.82,64.02 83.1,64.02 v83,64.01 | C9.2 85.75,72.96 83.82,71.03 83.1,71.03 v83,71.01
  Top 0.203: v140.7,25.51 R9.2 | IC21.3 89.65,38.56 v89.3,38.91
  Top 0.305: IC16.3 68.4,33.21 v68.2,33.21 | IC15.3 83.3,25.41 v82.6,25.41 | C3.2 v86.3,22.41 | C21.2 v97.5,13.21 | U$5.4 v104.89,21.92 v104.9,21.91 | IC4.8 v98.7,35.81 | IC4.13 104.98,40.91 v106.4,40.91 | C7.2 109.95,44.76 v110,44.81 | IC3.8 v98.7,46.81 | IC12.3 95.85,43.36 v96.2,43.71 | IC13.3 95.85,40.36 v96.2,40.71 | C24.2 v88.9,40.91 | IC18.28 82.98,42.3 v83,42.31 | IC18.25 82.98,40.39 v83,40.41 | IC18.34 v82.99,46.11 v83,46.11 | IC18.39 82.97,49.28 v83,49.31 | C11.2 86.75,51.26 v86.8,51.21 | v83,53.11 82.98,53.09 IC18.45 | IC18.48 82.97,55 v82.99,55.01 v83,55.01 | IC18.1 71.01,55 v71,55.01 | IC18.4 71.02,53.09 v71,53.11 | C17.2 67.25,51.26 v67.2,51.31 | IC18.10 70.93,49.28 v70.9,49.31 | IC18.15 v71,46.11 | C18.2 68.1,44.21 v67.2,44.21 | IC18.21 71.01,42.3 v71,42.31 | IC18.24 71.02,40.39 v71,40.41 | IC10.3 62.15,27.56 v62,27.41 | IC8.3 57.15,29.36 v57,29.21 | C22.2 v56,29.21 | IC5.3 52.65,29.26 v52.6,29.21 | IC11.3 52.4,23.86 v52.4,23.41 | IC9.3 57,23.71 v57,23.21 | C1.2 v48,26.01 | C20.2 56.75,35.56 v56.8,35.61 | C13.2 52,17.71 | 52,17.71 v52,18.71 | v53,18.71 52,17.71 | v53.4,17.81 53,17.41 C13.2 | v50.6,17.81 51,17.41 C13.2 | v51.1,18.71 52,17.81 C13.2 | C14.2 55.65,12.51 v56.1,12.51 | C14.2 56.05,11.76 v56.1,11.71 | C14.2 55.75,10.91 v56.1,10.91 | U$9.1 50.26,10.11 v51.3,10.11 | U$9.1 51.06,9.45 v51.3,9.21 | U$9.1 50.16,9.45 v51.3,8.31 | U$9.1 50.5,8.55 v50.5,8.31 | U$9.1 49.7,9.35 v49.7,8.31 | U$9.1 48.9,8.75 v48.9,8.31 | C19.2 87.2,33.16 v87.2,34.01 | IC6.3 83.35,29.41 v82.8,29.41 | C8.2 82.2,35.66 v82.2,36.41 | C12.2 85.9,44.31 v86.9,44.31 | IC2.8 98.64,58.07 v98.6,58.11 | IC3.13 104.98,51.91 v106.4,51.91 | C6.2 109.15,55.81 v110,55.81 | IC2.13 106.36,63.15 v106.4,63.11
  Top 0.305: C5.2 109.2,67.11 v110.1,67.11 | IC1.8 v98.7,69.31 | IC1.13 104.98,74.41 v106.4,74.41 | C4.2 109.75,78.26 v109.8,78.21 | IC17.28 82.96,64.05 v83,64.01 | IC17.25 82.87,62.14 v82.9,62.11 | IC17.24 72.09,62.11 v71,62.11 | IC17.21 72.08,64.01 v71,64.01 | C16.2 v67.2,66.01 | IC17.15 72.07,67.81 v71,67.81 | IC17.34 82.95,67.86 v83,67.81 | IC17.39 82.98,71.03 v83,71.01 | IC17.10 72.1,71.01 v71,71.01 | C15.2 v66.9,73.01 | IC17.4 71.03,74.84 v71,74.81 | IC17.1 71.03,76.75 v71,76.71 | R2.2 v141.2,79.01 | C23.2 v130,85.71 | IC20.3 129.4,91.71 v130.1,91.71 | IC19.3 v135.1,90.91 | R8.2 v26.5,44.61 | C2.2 23.75,44.66 v23.7,44.61 | IC7.7 v72.61,26.2 v72.6,26.21 | IC14.3 86.9,27.71 v86.8,27.61 | R6.1 141.55,19.91 v140.7,19.91 | R5.2 v140.7,22.51 | IC17.45 82.97,74.84 v83,74.81 | IC17.48 82.96,76.75 v83,76.71
  Top 0.508: v101.9,51.71 v103.3,51.71 | v102,62.61 v103.3,62.61
  Route15 0.508: v101.9,51.71 v103.3,51.71 | v102,62.61 v103.3,62.61
  other vias: 59.7,27.81 65.4,34.61 62.4,31.31 67.2,36.41 68.7,40.91 64.7,37.31 60.5,33.21 68.7,29.01 71.3,32.11 66.9,26.31 71,22.51 74.2,18.71 79.4,18.61 85.2,18.61 92.7,18.61 107.2,18.21 115.9,18.31 124.9,18.21 129.1,17.81 139.8,17.81 146.2,17.81 152,19.51 147.5,19.11 138.7,20.11 132.9,20.11 127.4,20.01 123.2,20.41 119.1,24.31 114.6,28.91 110.6,33.01 104.9,32.41 107.1,32.51 107,25.91 107.3,21.61 103.1,24.71 100.4,25.21 100.2,21.91 100.6,19.71 98.2,24.21 95.1,26.31 94.4,29.01 91,28.91 91.3,26.51 88.6,24.21 77.4,23.91 84.4,28.01 90.2,33.61 94.8,33.61 95.4,37.11 87.6,36.91 85.3,38.11 81.2,37.71 78.2,40.91 79.5,43.21 76.2,43.71 74.4,40.81 89.3,51.51 97.7,51.51 98.1,49.31 89.3,49.31 97.1,56.41 85.9,56.41 97.1,60.51 86.2,60.41 96,62.01 84.8,62.11 93.9,64.01 91.8,66.01 87.4,66.01 93.6,66.41 97.2,65.21 97,67.71 89.7,67.71 85.9,71.11 92.6,71.11 98.4,72.01 97.1,72.91 87.8,73.01 96.5,74.81 96,76.81 102.5,76.91 102.5,71.01 82.4,78.51 89.8,78.51 96.6,78.61 99.8,82.31 104.5,87.41 92.3,88.51 87.6,83.51 99.3,88.61 93.9,90.01 101.8,90.01 111.6,90.11 111.7,88.41 107.3,86.41 105.2,84.51 103.6,82.71 105.1,80.81 113.7,80.91 118.7,80.91 118,84.51 116.2,82.51 115.4,86.51 126.2,86.31 124.3,83.31 133.2,83.31 139.5,86.51 142.7,84.21 137.2,83.31 137.3,79.41 128.2,80.71 136.5,76.81 122.9,76.81 138.7,75.91 111.8,74.51 118.6,74.41 129.8,74.41 138.4,74.41 145.6,74.31 147,75.31 146.4,72.61 132.7,72.61 123.6,72.71 109.3,72.71 110,69.61 117.3,69.61 128.3,69.61 139.1,69.51 148,69.31 147.7,67.41 135,67.31 122.6,67.21 111,65.11 122.3,65.01 139,65.01 145.7,65.11 145.8,62.81 139.3,62.21 128,62.51 108.3,62.51 109.6,60.41 119.4,60.41 134.6,60.51 142.5,58.61 129.4,58.61 114.1,58.61 110.9,57.41 121.1,57.41 136.4,57.41 143,56.61 147.3,52.31 141.2,55.91 134.1,55.41 142.1,49.91 147.2,49.41 145.2,46.91 147.3,43.01 140,46.91 132.1,54.91 129.9,54.41 133.6,50.81 136.8,50.21 141.2,43.11 146.7,40.41 146.7,37.81 147.1,33.51 137.5,42.61 130.1,50.21 120.3,53.11 111.9,52.61 107.3,50.21 123,50.91 125.7,51.11 129.7,47.01 135.1,41.61 141.7,35.01 147.2,29.61 147.2,26.41 137.3,34.41 130.1,42.01 125.4,41.81 134,33.01 138.7,28.41 139.4,24.81 128.3,35.61 122.5,41.51 107.9,38.21 109.8,41.71 119.3,38.51 121.7,37.01 108.5,37.01 109.2,35.21 116.2,31.41 123.4,26.91 125.1,34.21 146.2,13.51 107,13.41 145.2,16.11 126.8,16.11 106.4,16.11 86.2,16.31 70.3,16.81 62.9,23.41 59.4,20.51 37.3,49.71 58.3,49.61 36.3,35.41 35.3,25.41 24.5,35.41 91,90.31 85.5,90.41 75,80.21 80.1,79.81 101.4,92.61 85.5,93.01 76.7,86.91 106.8,93.11 123.6,93.21 141.5,88.61 147.2,89.81 138.1,89.81 74.8,63.71 80.1,59.81 79.8,63.61 77.1,66.41 75.4,60.31 80.8,57.71 115.2,51.01 86.4,48.01 97,53.11 89,44.61 101.3,33.31 69.9,13.81 67.6,12.91 14.1,88.51 19.7,93.61 25.5,93.21 50.6,92.91 83.3,95.61 46.7,95.51 63.7,54.31 47.9,54.41 26.5,54.31 82.5,11.71 116.6,11.61 145.7,11.71 157.4,12.01 156.9,29.31 157.1,56.41 157.2,77.01 157.1,88.81 151,93.01 137,94.11 146.4,81.91 147,23.41 152.1,22.01 147.3,20.41 75.9,49.81 77.9,51.81
  pour Bottom: 8,4.01 8,10.01 1,10.01 1,90.01 8,90.01 8,96.01 154,96.01 154,95.01 154,91.01 159,91.01 159,9.01 154,9.01 154,4.01
  pour Top: 8,96.01 8,90.01 1,90.01 1,10.01 20,10.01 20,22.01 57,22.01 68.1,10.91 158,10.91 158,91.01 154,91.01 154,96.01
  pour Route15: 8,96.01 8,90.01 1,90.01 1,10.01 8,10.01 8,4.01 154,4.01 154,9.01 159,9.01 159,91.01 154,91.01 154,96.01
MOD_CLK_TIMING  (via drill 0.2, 0.25)
  Top 0.102: v118.5,35.98 125.88,35.98 141.12,20.74 142.54,20.74 143.25,20.03 R6.2 143.35,19.93 143.46,19.82 150.06,19.82 150.97,20.74 154.63,20.74 J1.A28
  Top 0.152: v118.2,38.21 117,38.21 IC22.1
  Route15 0.152: v118.5,35.98 118.2,36.28 v118.2,38.21
MOD_RESET  (via drill 0.2)
  Top 0.102: v102.63,42.58 102.52,42.68 98.95,42.68 98.85,42.58 95.91,42.58 IC12.2 | v107.69,42.58 122.93,42.58 142.95,22.57 143.25,22.57 R5.1 143.35,22.57 145.18,24.4 149.96,24.4 150.97,23.38 154.63,23.38 J1.A27
  Bottom 0.102: v107.69,42.58 v102.63,42.58
N$1
  Top 0.102: IC2.14 104.95,64.43 103.83,64.43 103.02,65.24 103.02,67.37 104.95,69.3 IC1.9
N$2
  Top 0.102: IC3.14 104.95,53.25 104.14,53.25 102.81,54.57 102.81,55.89 104.95,58.03 IC2.9
N$3
  Top 0.102: IC4.14 104.95,42.18 104.64,42.18 103.83,42.99 103.83,45.63 104.95,46.75 IC3.9
N$4
  Top 0.102: IC7.6 73.96,27.55 74.67,27.55 79.65,32.52 80.06,32.52 IC7.13
N$5
  Top 0.102: IC6.2 83.31,30.09 80.16,30.09 IC7.11
N$6
  Top 0.102: IC5.2 52.62,30.59 48.15,30.59 R1.1 48.05,30.49 48.05,28.66 C1.1
N$7
  Top 0.102: IC10.4 63.9,28.16 69.19,28.16 73.55,32.52 73.86,32.52 IC7.2 73.96,32.63 74.47,33.13 81.07,33.13 81.28,32.93 81.28,32.12 80.46,31.31 80.16,31.31 IC7.12
N$8
  Top 0.102: IC9.4 58.92,23.89 58.92,24.4 61.46,26.94 61.46,28.26 61.87,28.66 62.07,28.66 IC10.2
N$9
  Top 0.102: IC5.4 54.35,29.88 56.38,29.88 57.09,30.59 IC8.2 57.2,30.59 57.71,30.09 57.71,29.27 57.2,28.77 57.2,25.21 IC9.1
N$10
  Top 0.2: R8.1 25.1,47.36 | 25.1,47.36 C2.1 21.5,47.36 R3.2 | IC11.2 39.85,24.76 25.1,39.51 25.1,47.36
N$11
  Top 0.102: IC11.4 54.35,24.19 56.69,24.19 57.09,24.6 IC9.2
N$12
  Top 0.2: R3.1 PAD1.1
N$13
  Top 0.102: IC12.1 95.91,41.87 99.77,41.87 99.97,42.07 IC4.3
N$14
  Top 0.102: IC13.1 95.91,38.93 97.43,38.93 99.36,40.86 99.97,40.86 IC4.4
N$15
  Top 0.102: IC6.4 85.14,29.37 86.86,29.37 IC14.1
N$16
  Top 0.2: R4.1 82,22.41 C3.1 83.6,24.88 83.95,25.23 83.95,25.8 83.83,25.91 83.64,25.91 IC15.2
N$17
  Top 0.102: IC15.4 85.14,25.51 85.95,26.33 86.05,26.33 86.25,26.53 86.25,28.26 86.66,28.66 86.86,28.66 IC14.2
N$18
  Top 0.102: IC16.4 70.1,33.85 73.86,33.85 IC7.1
N$19
  Top 0.102: IC17.47 81.89,76.21 96.52,76.21 99.06,78.75 102.92,78.75 104.64,77.03 104.95,77.03 IC1.15
N$20
  Top 0.102: IC17.46 81.89,75.5 97.02,75.5 99.67,78.14 99.97,78.14 IC1.1
N$21
  Top 0.102: IC17.44 81.89,74.28 97.13,74.28 99.77,76.92 99.97,76.92 IC1.2
N$22
  Top 0.102: IC17.43 81.89,73.67 82.9,73.67 83.31,74.08 98.14,74.08 99.67,75.6 99.97,75.6 IC1.3
N$23
  Top 0.102: IC17.41 81.89,72.35 84.83,72.35 85.14,72.66 85.14,73.57 85.24,73.67 97.94,73.67 98.95,72.66 101.09,72.66 101.19,72.76 101.19,73.47 100.27,74.38 100.07,74.38 IC1.4
N$24
  Top 0.102: IC17.40 81.78,71.74 81.28,71.74 80.97,72.05 80.97,73.16 81.07,73.27 82.8,73.27 83.41,73.88 99.26,73.88 99.97,73.16 IC1.5
N$25
  Top 0.102: IC17.38 81.89,70.42 98.34,70.42 99.77,71.84 99.97,71.84 IC1.6
N$26
  Top 0.102: IC17.37 81.89,69.81 99.26,69.81 99.97,70.52 IC1.7
N$27
  Top 0.102: IC17.36 81.89,69.1 98.24,69.1 99.87,67.47 101.09,67.47 102.71,65.85 102.71,65.14 103.93,63.92 106.07,63.92 106.17,64.02 106.17,64.73 105.25,65.65 105.05,65.65 IC2.15
N$28
  Top 0.102: IC17.35 98.45,68.49 99.97,66.97 IC2.1
N$29
  Top 0.102: IC17.33 81.89,67.17 98.24,67.17 99.67,65.75 99.97,65.75 IC2.2
N$30
  Top 0.102: IC17.32 81.78,66.56 81.38,66.56 80.77,65.95 80.77,62.09 84.02,58.84 101.09,58.84 101.39,59.14 101.39,63.31 100.38,64.33 100.07,64.33 IC2.3
N$31
  Top 0.102: IC17.30 81.89,65.34 84.83,65.34 85.14,65.65 85.14,66.66 85.24,66.76 92.05,66.76 95.19,63.61 99.56,63.61 99.97,63.21 IC2.4
N$32
  Top 0.102: IC17.29 81.78,64.63 81.28,64.63 80.97,64.33 80.97,63.21 81.07,63.11 98.24,63.11 99.46,61.89 99.97,61.89 IC2.5
N$33
  Top 0.102: IC17.27 98.24,63.41 99.26,62.39 101.09,62.39 101.19,62.29 101.19,61.48 100.38,60.67 100.07,60.67 IC2.6
N$34
  Top 0.102: IC17.26 81.89,62.7 96.41,62.7 99.77,59.35 99.97,59.35 IC2.7
N$35
  Top 0.102: IC18.47 97.13,54.37 98.95,56.2 101.09,56.2 102.61,54.67 102.61,53.96 103.93,52.64 105.96,52.64 106.17,52.84 106.17,53.56 105.35,54.37 105.05,54.37 IC3.15
N$36
  Top 0.102: IC18.46 81.89,53.76 97.84,53.76 99.77,55.69 99.97,55.69 IC3.1
N$37
  Top 0.102: IC18.44 81.89,52.54 97.84,52.54 99.67,54.37 99.97,54.37 IC3.2
N$38
  Top 0.102: IC18.43 83.41,51.83 83.92,52.34 98.95,52.34 99.77,53.15 99.97,53.15 IC3.3
N$39
  Top 0.102: IC18.41 81.89,50.61 98.45,50.61 99.67,51.83 99.97,51.83 IC3.4
N$40
  Top 0.102: IC18.40 81.89,50 99.36,50 99.97,50.61 IC3.5
N$41
  Top 0.102: IC18.38 81.89,48.68 99.36,48.68 99.97,49.29 IC3.6
N$42
  Top 0.102: IC18.37 81.89,47.97 85.44,47.97 86.25,47.15 98.04,47.15 98.95,48.07 99.97,48.07 IC3.7
N$43  (via drill 0.2)
  Top 0.102: v103.23,47.05 102.91,47.36 98.55,47.36 98.14,46.95 85.24,46.95 84.83,47.36 81.89,47.36 IC18.36 | v106.27,44.01 105.56,44.01 105.05,43.5 IC4.15
  VCC 0.102: v103.23,47.05 104.65,47.05 106.07,45.63 106.07,45.22 105.86,45.02 105.86,44.41 v106.27,44.01
N$44
  Top 0.102: IC18.35 81.89,46.65 98.14,46.65 99.16,45.63 100.99,45.63 101.39,45.22 101.39,43.29 100.99,42.89 99.06,42.89 98.85,43.09 98.85,43.8 99.67,44.61 99.97,44.61 IC4.1
N$45
  Top 0.102: IC18.33 81.89,45.43 100.88,45.43 101.19,45.12 101.19,44.31 100.38,43.5 100.07,43.5 IC4.2
N$46
  Top 0.102: IC12.4 94.08,43.19 88.69,43.19 86.97,44.92 81.89,44.92 IC18.32
N$47
  Top 0.102: IC21.4 89.81,36.89 89.4,36.89 82.8,43.5 81.89,43.5 IC18.30
N$48
  Top 0.102: IC18.29 81.89,42.89 83.1,42.89 89.4,36.59 89.4,36.49 89.81,36.08 96.21,36.08 99.67,39.53 99.97,39.53 IC4.5
N$49
  Top 0.102: IC18.27 81.89,41.57 82.8,41.57 83.71,40.65 83.71,37.6 85.44,35.88 97.23,35.88 99.67,38.32 99.97,38.32 IC4.6
N$50
  Top 0.102: IC18.26 81.89,40.96 83.1,40.96 83.51,40.55 83.51,37.5 85.34,35.67 97.84,35.67 99.16,36.99 99.97,36.99 IC4.7
N$51
  Top 0.102: JP1.2 102.61,27.24 JP1.4 | IC16.2 68.47,34.45 77.82,34.45 78.94,33.34 81.48,33.34 83.71,31.1 83.82,31.1 85.03,29.88 94.89,29.88 97.43,27.34 JP1.8
  Bottom 0.102: JP1.4 100.07,27.24 JP1.6 97.53,27.24 JP1.8
N$52  (via drill 0.2)
  Top 0.102: v99.26,28.46 99.06,28.25 99.06,26.83 99.46,26.43 99.46,21.55 98.65,20.74 98.24,20.74 U$5.6
  Bottom 0.102: v99.26,28.46 98.75,28.97 98.34,28.97 97.53,29.78 JP1.7
N$53
  Top 0.102: U$5.7 98.24,19.42 98.55,19.42 101.39,22.26 101.39,28.66 JP1.3
N$54
  Top 0.102: U$5.2 103.32,19.42 102.92,19.42 101.6,20.74 101.6,27.65 102.81,28.87 102.92,28.87 103.53,29.48 103.53,30.09 102.81,30.8 100.99,30.8 100.07,29.88 JP1.5
N$55
  Top 0.102: IC19.2 134.41,90.33 149.15,90.33 149.25,90.44 153.62,90.44 154.63,89.42 J1.A1
N$56
  Top 0.102: IC21.1 91.23,38.62 92.45,38.62 94.08,40.25 IC13.4
N$57  (via drill 0.25)
  Top 0.152: IC22.4 110.25,39.66 v109.4,38.81 | v97.4,39.81 96.3,39.81 96.27,39.78 96.12,39.78 IC13.2
  Route15 0.152: v97.4,39.81 100.19,37.02 106.57,37.02 106.85,37.3 106.85,37.85 107.82,38.81 v109.4,38.81
N$58
  Top 0.152: IC22.2 117.12,39.28 117.27,39.28 118.65,40.66 IC23.4
N$106
  Top 0.102: IC20.4 127.61,91.76 104.34,91.76 101.29,94.81 23.87,94.81 10.36,81.29 R7.2
N$123
  Top 0.102: R7.1 8.63,81.29 5.08,81.29 LED1.A
PICO
  Top 0.102: IC1.14 105.05,75.7 137.16,75.7 147.32,85.86 153.72,85.86 154.63,86.78 J1.A2
PROG  (via drill 0.2)
  Top 0.102: v79.57,45.43 72.13,45.43 IC18.16 | v106.37,37.5 122.4,37.5 124.96,37.5 140.71,21.75 148.03,21.75 149.55,23.28 J1.C27
  Top 0.152: IC23.2 121.12,39.74 121.27,39.74 122.4,38.61 122.4,37.5
  Route15 0.102: v79.57,45.43 97.33,45.43 105.25,37.5 v106.37,37.5
RCLK
  Top 0.102: IC14.4 88.69,28.05 95.3,28.05 97.02,26.33 97.84,26.33 98.6,27.09 98.6,32.88 103.83,38.11 103.83,38.72 104.64,39.53 104.95,39.53 IC4.12 105.05,39.64 105.86,39.64 106.88,40.65 106.88,42.48 108.1,43.7 108.1,47.76 105.56,50.3 | 105.56,50.3 105.25,50.61 105.05,50.61 IC3.12 | 105.56,61.58 108.1,59.04 108.1,55.08 106.88,53.86 106.88,51.63 105.56,50.3 | 105.56,61.58 105.35,61.79 105.05,61.79 IC2.12 105.56,61.58 | 105.56,61.58 108.1,64.12 108.1,70.32 105.35,73.06 105.05,73.06 IC1.12
RES  (via drill 0.2)
  Top 0.102: v83,39.64 81.48,39.64 76.3,44.82 72.13,44.82 IC18.17 | v106.27,36.49 125.67,36.49 141.22,20.94 149.45,20.94 149.55,20.84 J1.C28
  Route15 0.102: v83,39.64 96.21,39.64 99.36,36.49 v106.27,36.49
SCLK  (via drill 0.2)
  Top 0.102: U$5.1 103.42,18.2 103.83,18.2 106.07,20.43 106.07,28.87 105.15,29.78 JP1.1 105.05,29.88 103.63,31.31 103.63,37.3 104.64,38.32 104.95,38.32 IC4.11 105.05,38.42 105.35,38.42 107.69,40.75 v107.69,40.86 | IC20.2 129.43,90.94 v130.15,90.94 132.58,90.94 IC19.4 | IC1.11 105.05,71.84 105.56,71.34 v106.37,71.34 106.37,68.9 106.07,68.59 105.05,68.59 103.83,67.37 103.83,66.56 103.93,66.46 105.76,66.46 106.37,65.85 106.37,63.92 106.17,63.72 104.03,63.72 103.83,63.51 103.83,61.48 104.64,60.67 104.95,60.67 IC2.11 105.05,60.57 105.25,60.57 106.37,59.45 106.37,57.62 106.07,57.31 105.05,57.31 103.83,56.1 103.83,55.28 103.93,55.18 105.76,55.18 106.37,54.57 106.37,52.74 106.07,52.44 103.93,52.44 103.83,52.34 103.83,50.2 104.64,49.39 104.95,49.39 IC3.11 105.05,49.29 105.35,49.29 107.59,47.05 v107.59,46.44
  Route15 0.102: v130.15,90.94 125.98,90.94 v106.37,71.34
  Bottom 0.102: v107.69,40.86 108.71,41.87 108.71,45.33 v107.59,46.44
SPI_RESET
  Top 0.102: IC10.1 62.18,29.37 62.38,29.37 63.09,28.66 63.09,27.75 73.55,17.28 151.69,17.28 154.23,19.82 155.14,19.82 155.65,20.33 155.65,78.24 154.73,79.16 J1.A5 154.63,79.26 153.62,80.28 149.25,80.28 148.03,79.06 143.86,79.06 R2.1
SRCLR  (via drill 0.2)
  Top 0.102: v102.71,50.15 102.71,50.1 104.64,48.17 104.95,48.17 IC3.10 | v103.32,54.77 103.32,55.89 104.95,57.52 105.96,57.52 106.17,57.72 106.17,58.43 105.35,59.25 105.05,59.25 IC2.10 | v103.53,65.44 103.53,67.37 104.95,68.8 105.96,68.8 106.17,69 106.17,69.71 105.35,70.52 105.05,70.52 IC1.10 | IC8.4 58.92,29.78 62.58,29.78 63.29,29.07 63.29,27.85 73.55,17.59 104.54,17.59 106.27,19.32 106.27,32.93 103.83,35.37 103.83,36.18 104.64,36.99 104.95,36.99 IC4.10 105.05,37.1 105.25,37.1 108.2,40.04 v108.2,42.07
  Bottom 0.102: v103.53,65.44 102.63,64.54 102.63,58.35 102.1,57.82 102.1,55.99 v103.32,54.77 102.61,54.06 102.61,50.25 v102.71,50.15 102.71,49.59 108.2,44.11 v108.2,42.07
VCC  (via drill 0.2)
  Top 0.102: v70.75,51.26 70.61,51.32 69.9,51.32 C17.1 69.8,51.32 69.39,51.32 68.47,52.23 15.03,52.23 PAD2.1
  Top 0.152: IC22.5 114.25,38.36 v114.2,38.41 | IC23.5 118.45,39.36 v118.4,39.41
  Top 0.203: IC21.5 91.45,36.86 v91.7,36.61
  Top 0.305: IC16.5 70.1,35.21 v70.8,35.21 | IC7.14 v81.39,33.82 v81.4,33.81 81.5,33.91 C8.1 | C19.1 87.25,30.66 v87.2,30.61 | v85.8,30.81 85.65,30.66 IC6.5 | IC14.5 v89.2,29.41 | v85.8,26.81 IC15.5 | R4.2 81.7,20.11 v81.6,20.01 | C21.1 97.6,15.96 v97.6,16.61 | U$5.8 96.7,18.11 v96.6,18.21 | IC4.16 105.07,44.81 v106.4,44.81 107.35,44.81 C7.1 | IC12.5 93.45,41.86 v93.4,41.91 | IC13.5 93.45,38.86 v93.4,38.91 | C24.1 v92.5,40.91 | C12.1 84.1,44.21 v83.2,44.21 v83.19,44.2 IC18.31 | IC18.42 83.17,51.19 v83.2,51.21 83.25,51.26 C11.1 | IC18.7 70.82,51.19 v70.75,51.26 | IC18.18 70.81,44.2 v70.75,44.26 C18.1 | IC10.5 v64.6,29.41 | IC8.5 58.9,31.21 v59.6,31.21 | IC5.5 54.4,31.21 v55,31.21 | v56.8,32.01 56.75,32.06 C20.1 | C22.1 v56,25.81 | v55,25.41 IC11.5 | IC9.5 58.85,25.66 v59,25.81 | R1.2 46.3,30.41 v45.6,30.41 | IC2.16 106.34,66.96 | 106.34,66.96 v106.4,67.01 | C5.1 107.34,66.96 106.34,66.96 | IC1.16 v106.2,78.21 107.1,78.21 C4.1 | C10.1 v83.2,66.01 83.14,65.95 IC17.31 | IC17.18 70.86,65.95 v70.8,66.01 C16.1 | C9.1 v83.2,73.01 83.12,72.94 IC17.42 | IC17.7 70.67,72.94 v70.6,73.01 C15.1 | C23.1 v130,89.21 | IC20.5 127.65,89.86 v127.6,89.81 | IC19.5 132.65,89.06 v132.6,89.01 | C6.1 106.45,55.76 v106.4,55.81 105.07,55.81 IC3.16
  Top 1.016: U$9.2 45.35,11.76 | 45.35,11.76 45.2,11.91 | 45.35,11.76 43.75,11.76 v43.5,11.51
  Top 1.27: U$9.2 C14.1
  other vias: 44.25,13.01 43.5,13.01 42.75,13.01 42.75,12.26 42.75,11.51 42.75,10.76 42.75,10.01 43.5,10.01 44.25,10.01 44.25,10.76 43.5,10.76 44.25,11.51 44.25,12.26 43.5,12.26 44.25,13.76 43.5,13.76 42.75,13.76 51.2,11.81 13.4,52.81 16.8,52.81 13.4,51.61 16.8,51.61 42,13.76 42,13.01 42,12.26 42,11.51 42,10.76 42,10.01 51.2,12.51 51.2,11.11
  pour Top (no thermals): 47.5,8.26 47.5,19.76 29,19.76 21.5,19.76 21.5,4.01 21.5,3.76 47.5,3.76
  pour VCC: 1,99.01 1,1.01 159,1.01 159,99.01
WE  (via drill 0.2)
  Top 0.102: v100.07,35.06 85.64,35.06 77.82,42.89 72.13,42.89 IC18.20
  Route15 0.102: v100.07,35.06 106.07,35.06 121.92,19.21 146.16,19.21 149.63,15.74 J1.C30

### Text on the board
tPlace: SPI Clock Indicator | SPI2Parallel Interface Card V1.1 / by SOR@DKFZ | Register Reset Button | 12 | 8 | 4 | 0 | Delay (ns)